# Altium project 724452_RPL-HX_Mobile_AEP_Rev0p91.PrjPcb (part 1 of 13)
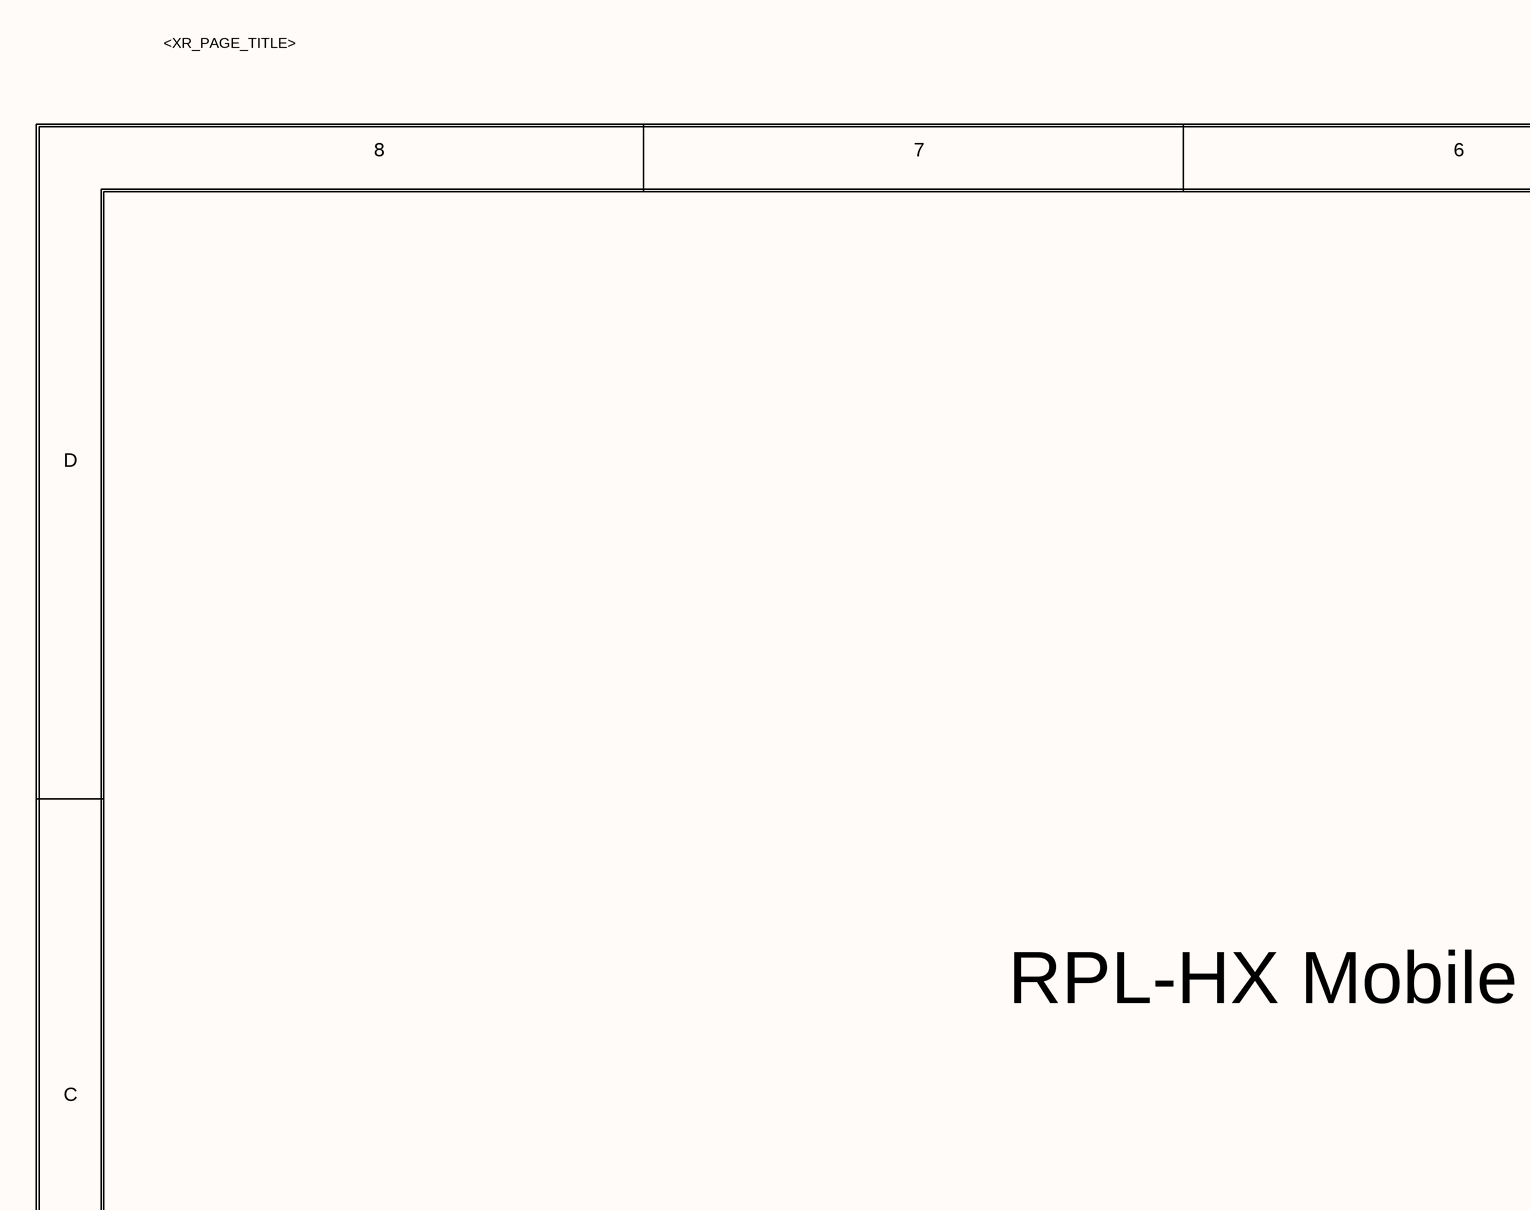
[diagram p0: 0001_TITLE.SchDoc, top left]
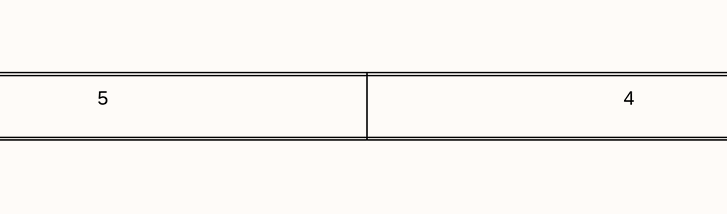
[diagram p1: 0001_TITLE.SchDoc, top middle]
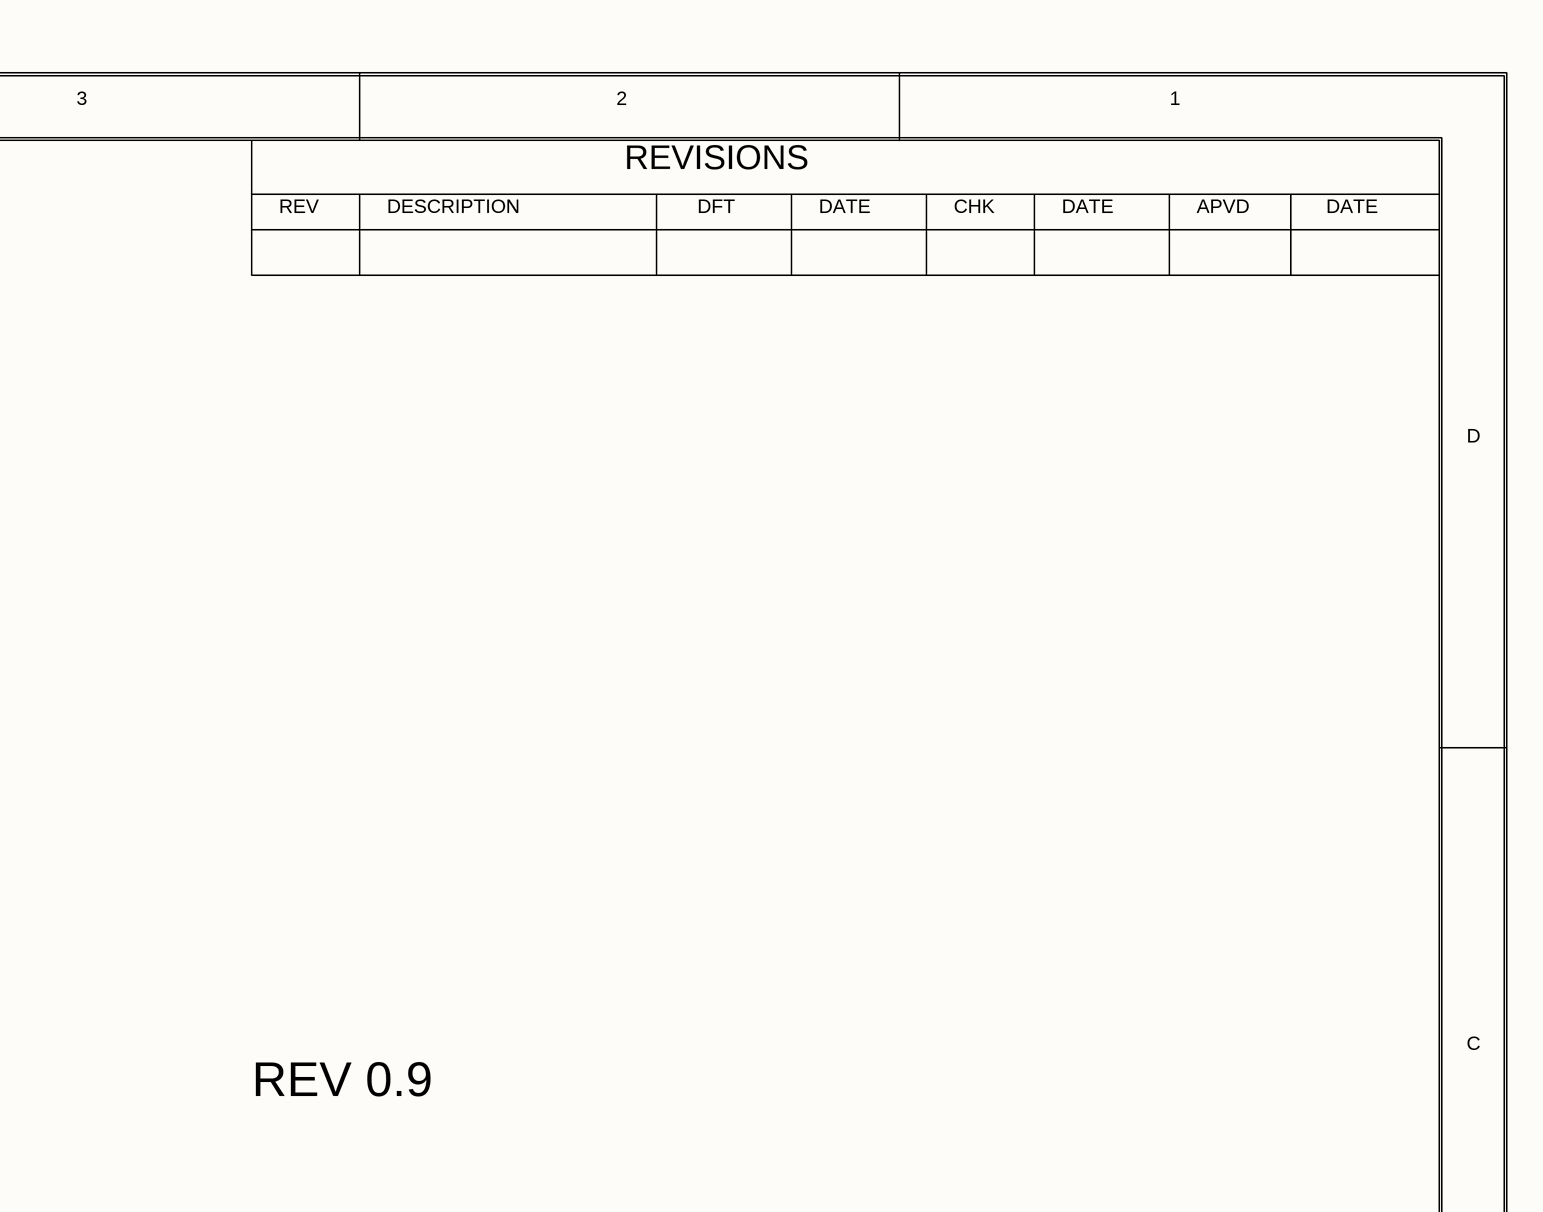
[diagram p2: 0001_TITLE.SchDoc, top right]
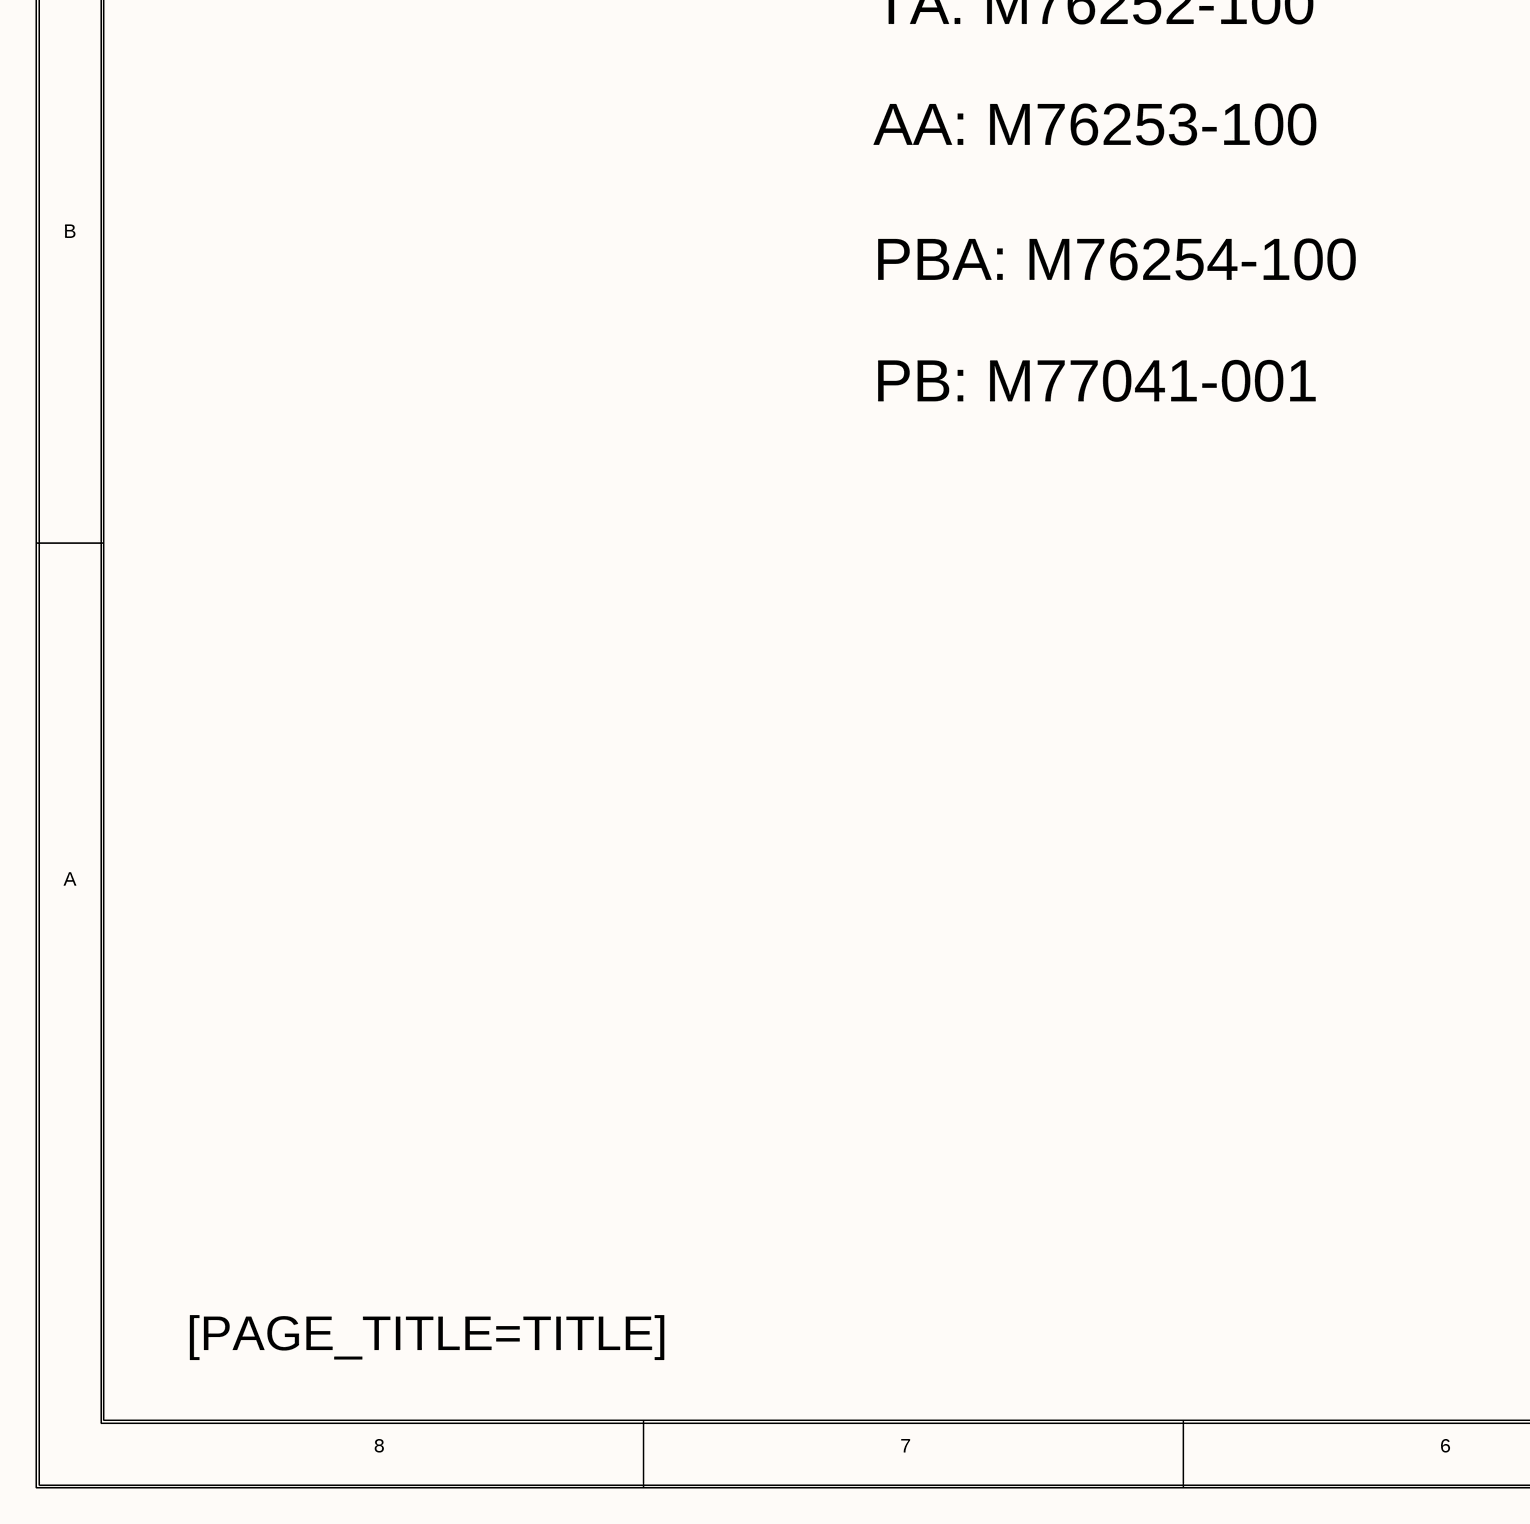
[diagram p3: 0001_TITLE.SchDoc, bottom left]
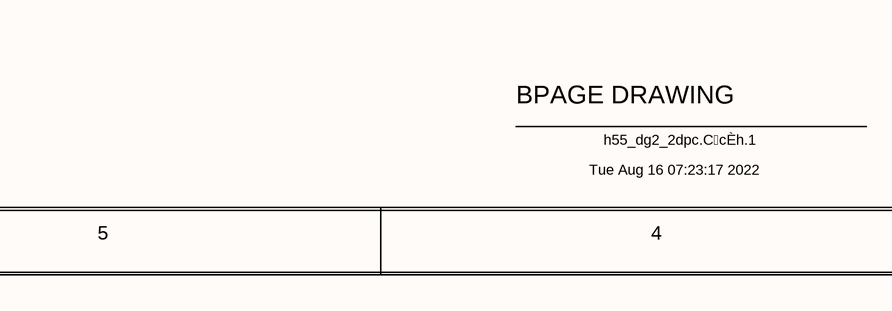
[diagram p4: 0001_TITLE.SchDoc, bottom middle]
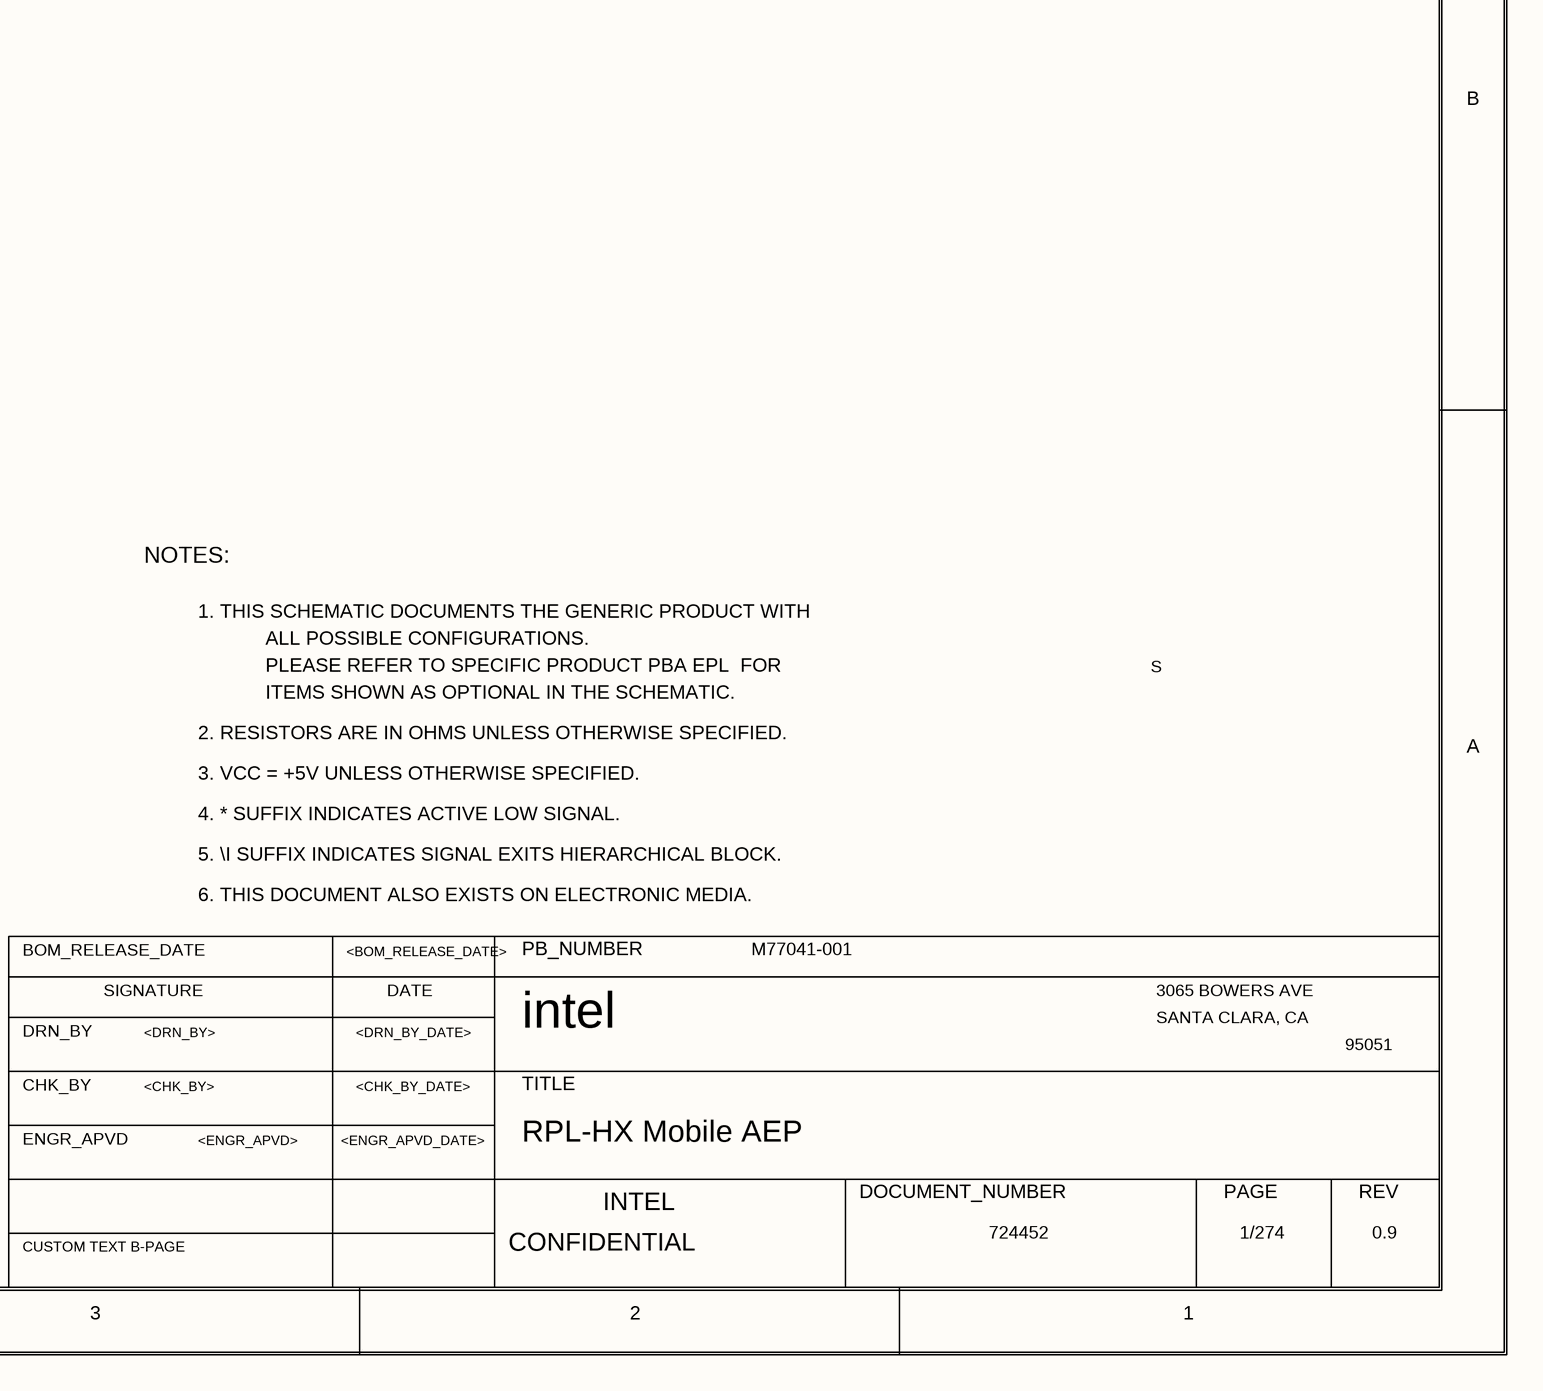
[diagram p5: 0001_TITLE.SchDoc, bottom right]
57 sheets, 1108 parts. Net scope: flat (ports and power ports of the same name join across sheets).
Sheets:
  0001_TITLE.SchDoc
  0002_INDEX -1.SchDoc
  0003_INDEX -2.SchDoc
  0004_INDEX -3.SchDoc
  0005_BLOCK DIAGRAM - MA.SchDoc
  0006_BLOCK DIAGRAM - PO.SchDoc
  0012_Processor - PEG, D.SchDoc
  0013_Processor - DISPLA.SchDoc
  0014_Processor - MEMORY.SchDoc
  0015_Processor - MEMORY.SchDoc
  0016_Processor - PM , C.SchDoc
  0017_Processor - MISC.SchDoc
  0021_Processor PD BOM -.SchDoc
  0022_Processor - CPU ST.SchDoc
  0024_DDR5 SODIMM CONTRO.SchDoc
  0026_DDR5 SODIMM CONTRO.SchDoc
  0029_System_debug_conne.SchDoc
  0030_DEBUG_CARD_SPI_SIG.SchDoc
  0031_DEBUG-XDP_SERIES_T.SchDoc
  0032_DEGUG-JTAG.SchDoc
  0034_PCH_CLOCK.SchDoc
  0035_PCH H CLOCK OPTION.SchDoc
  0036_PCH_DMI.SchDoc
  0037_PCH_PCIe_SATA.SchDoc
  0038_PCH_USB.SchDoc
  0039_GPP_C_D_E.SchDoc
  0040_GPP_I_J_K_R_S.SchDoc
  0041_PCH_PWR_GND.SchDoc
  0042_PCH_PI_BOM.SchDoc
  0043_GPP_MUX_E.SchDoc
  0044_RPL PCH H GPIO OPT.SchDoc
  0045_PCH STRAPS 1.SchDoc
  0046_PCH STRAPS 2.SchDoc
  0047_PCH VALIDATION.SchDoc
  0049_GLITCH FREE CIRCUI.SchDoc
  0052_PCIe_X16.SchDoc
  0053_PCIE GEN5_MISC.SchDoc
  0054_eDP_CONNECTOR.SchDoc
  0055_LED CON.SchDoc
  0058_DISPLAY SHIFT-POWE.SchDoc
  0059_CAMERA_CONNECTOR.SchDoc
  0062_HDMI0_CONNECTOR .SchDoc
  0063_HDMI1_CONNECTOR.SchDoc
  0071_HSIO MUXING -2.SchDoc
  0072_HSIO MUXING -3.SchDoc
  0073_HSIO MUXING -4.SchDoc
  0074_S0IX_REQ_ACK_OPTIO.SchDoc
  0076_TBT_0_PA_CONNECTOR.SchDoc
  0077_TBT_0_PB_CONNECTOR.SchDoc
  0082_USB3.SchDoc
  0083_USB3.SchDoc
  0084_USB3.SchDoc
  0090_USB3.SchDoc
  0091_USB3.SchDoc
  0093_M.2 KEY-E WLAN-BT.SchDoc
  0095_GBIT LAN - FOXVILLE LAN PHY CHIP.SchDoc
  0096_CONNECTIVITY - FOX.SchDoc

## Sheet 0001_TITLE.SchDoc
size 848 x 558 mm

### Notes on the sheet
- <XR_PAGE_TITLE>
- 8
- 7
- 6
- 5
- 4
- 3
- 2
- 1
- REVISIONS
- REV
- DESCRIPTION
- DFT
- DATE
- CHK
- APVD
- D
- RPL-HX Mobile AEP
- C
- REV 0.9
- TA: M76252-100
- AA: M76253-100
- B
- PBA: M76254-100
- PB: M77041-001
- NOTES:
- 1. THIS SCHEMATIC DOCUMENTS THE GENERIC PRODUCT WITH
- PLEASE REFER TO SPECIFIC PRODUCT PBA EPL  FOR
- ALL POSSIBLE CONFIGURATIONS.
- S
- 2. RESISTORS ARE IN OHMS UNLESS OTHERWISE SPECIFIED.
- ITEMS SHOWN AS OPTIONAL IN THE SCHEMATIC.
- A
- 3. VCC = +5V UNLESS OTHERWISE SPECIFIED.
- 4. * SUFFIX INDICATES ACTIVE LOW SIGNAL.
- 5. \I SUFFIX INDICATES SIGNAL EXITS HIERARCHICAL BLOCK.
- 6. THIS DOCUMENT ALSO EXISTS ON ELECTRONIC MEDIA.
- BOM_RELEASE_DATE
- SIGNATURE
- <BOM_RELEASE_DATE>
- PB_NUMBER
- M77041-001
- 3065 BOWERS AVE
- DRN_BY
- <DRN_BY>
- <DRN_BY_DATE>
- intel
- SANTA CLARA, CA
- 95051
- ENGR_APVD
- CHK_BY
- <CHK_BY>
- <ENGR_APVD>
- <ENGR_APVD_DATE>
- <CHK_BY_DATE>
- TITLE
- BPAGE DRAWING
- INTEL
- DOCUMENT_NUMBER
- PAGE
- [PAGE_TITLE=TITLE]
- Tue Aug 16 07:23:17 2022
- h55_dg2_2dpc.CcÈh.1
- CUSTOM TEXT B-PAGE
- CONFIDENTIAL
- 724452
- 1/274
- 0.9

## Sheet 0002_INDEX -1.SchDoc
size 891 x 558 mm
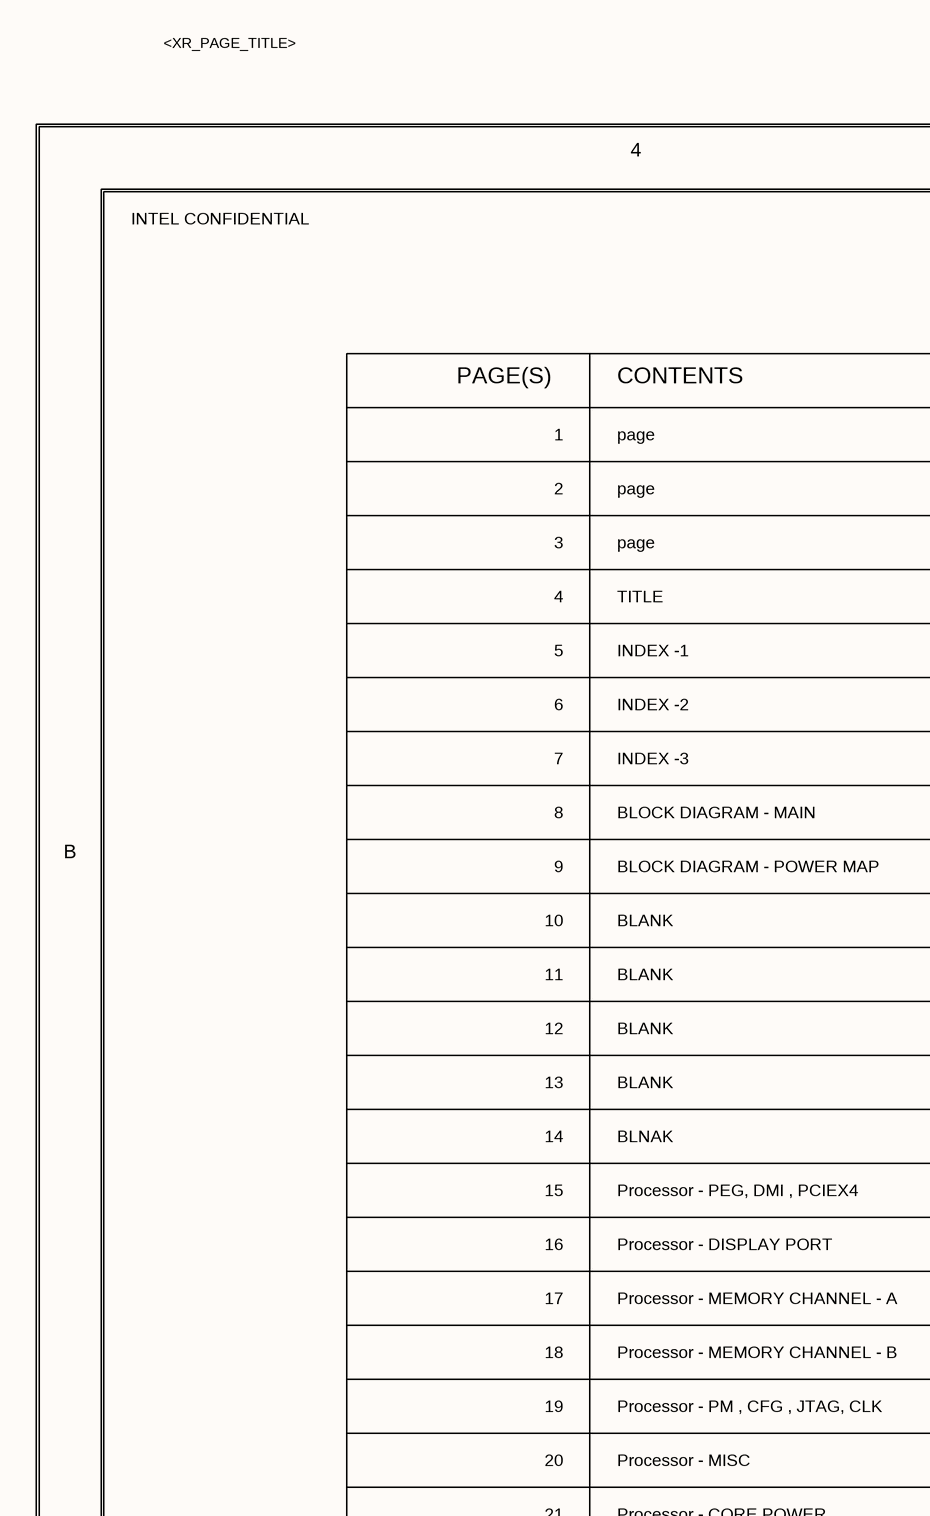
[diagram p6: 0002_INDEX -1.SchDoc, top left]
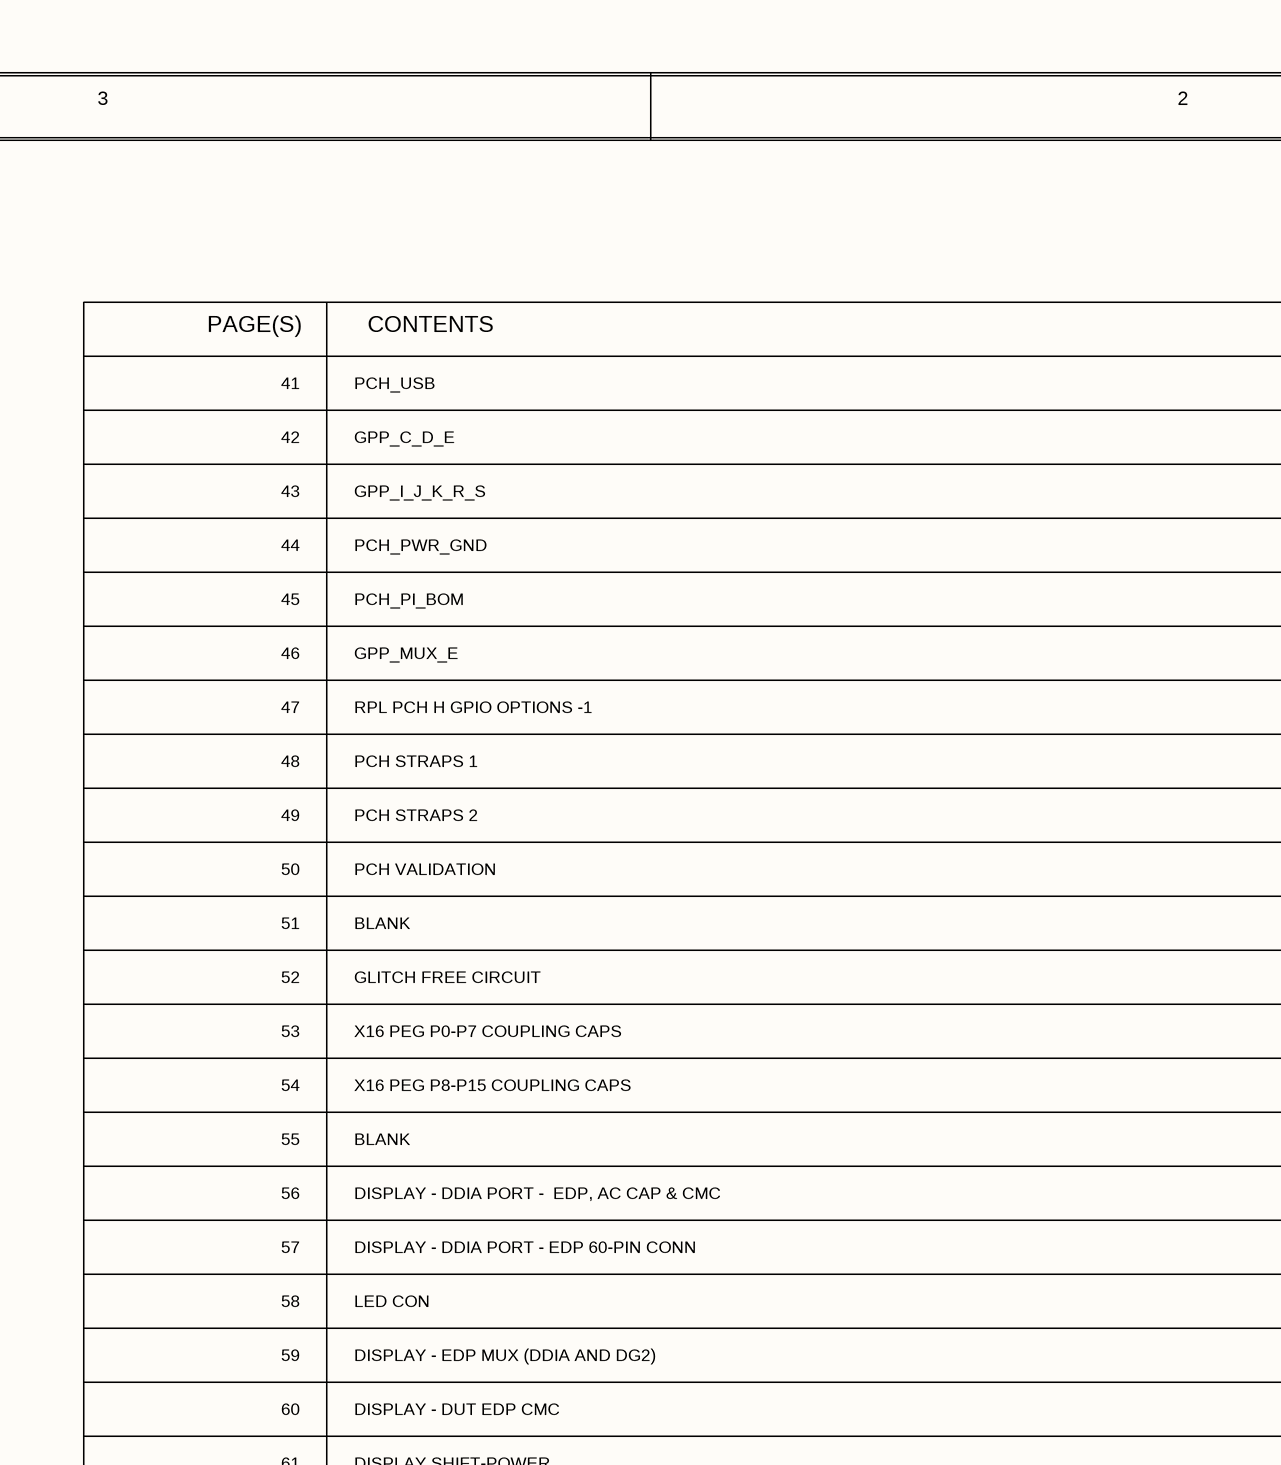
[diagram p7: 0002_INDEX -1.SchDoc, top middle]
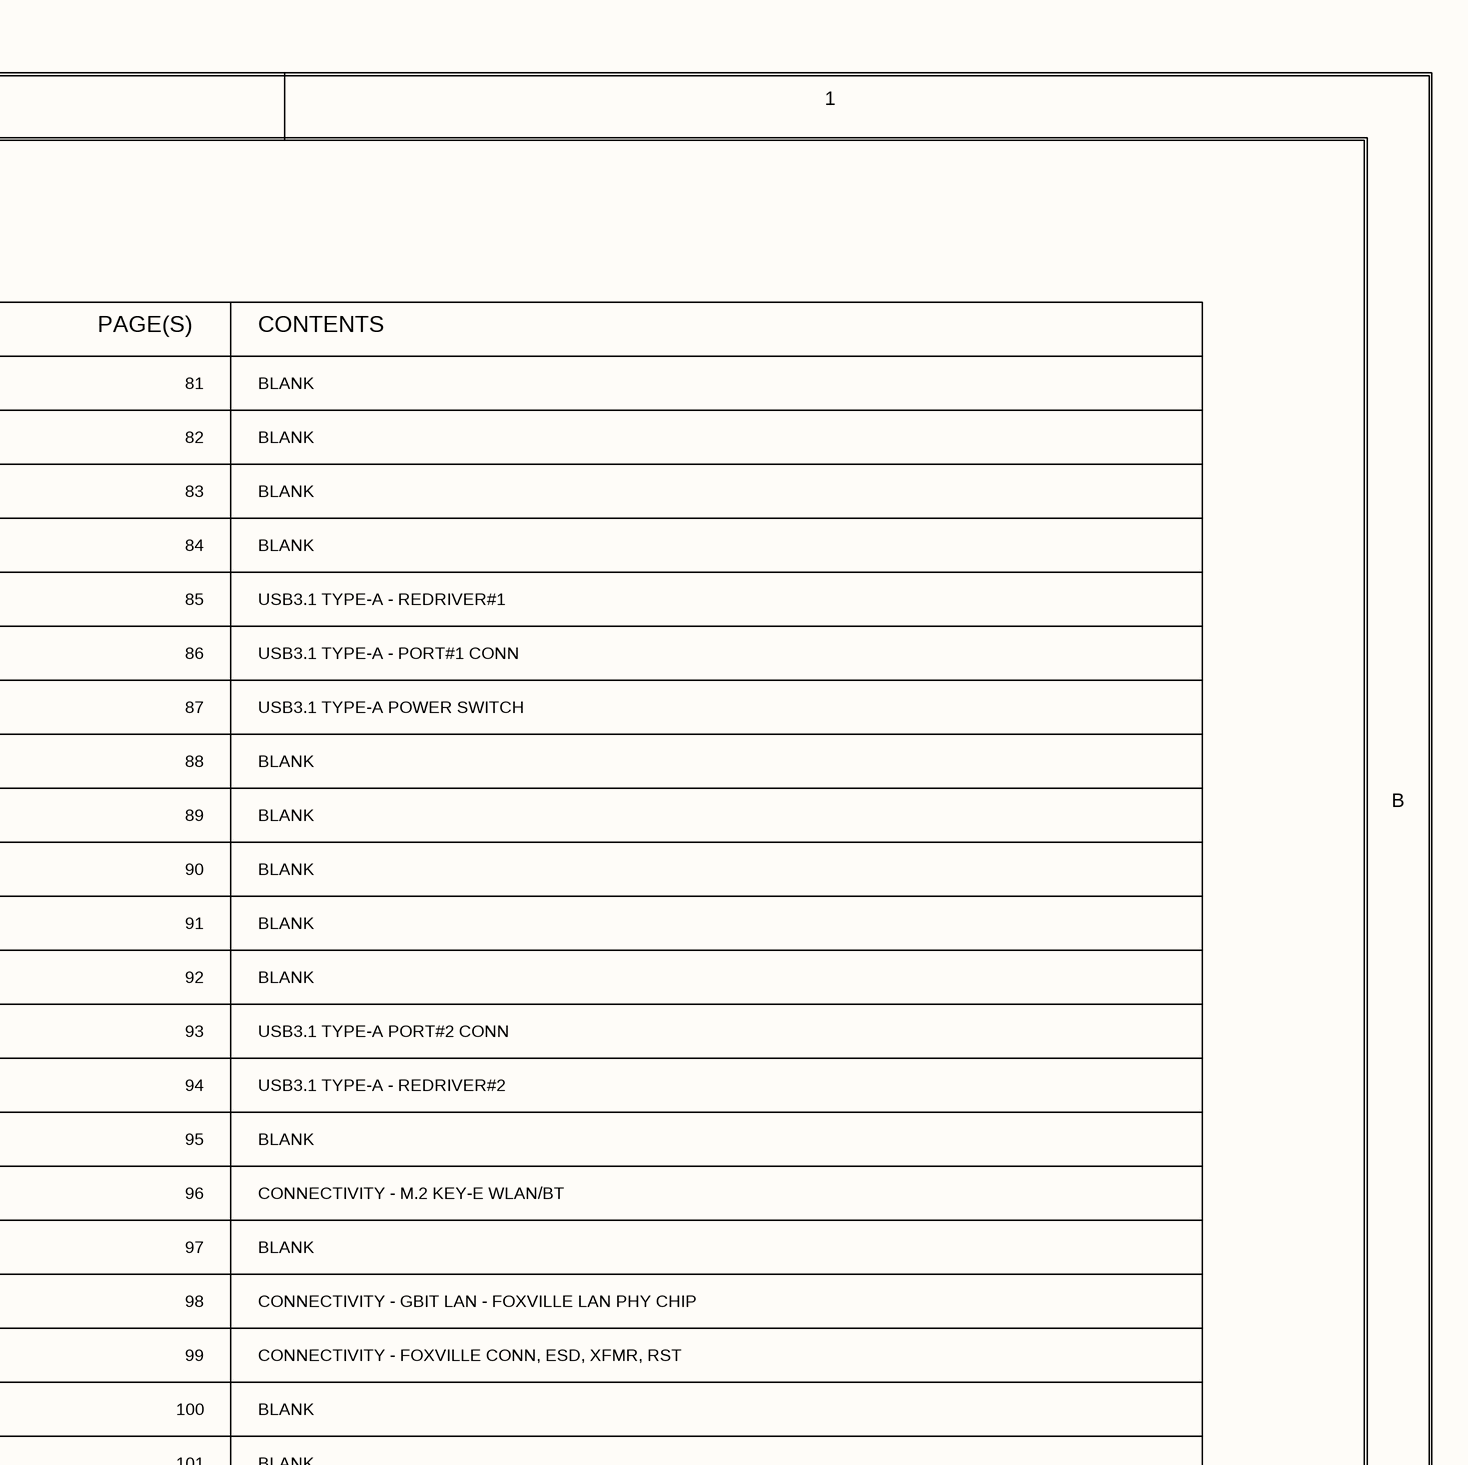
[diagram p8: 0002_INDEX -1.SchDoc, top right]
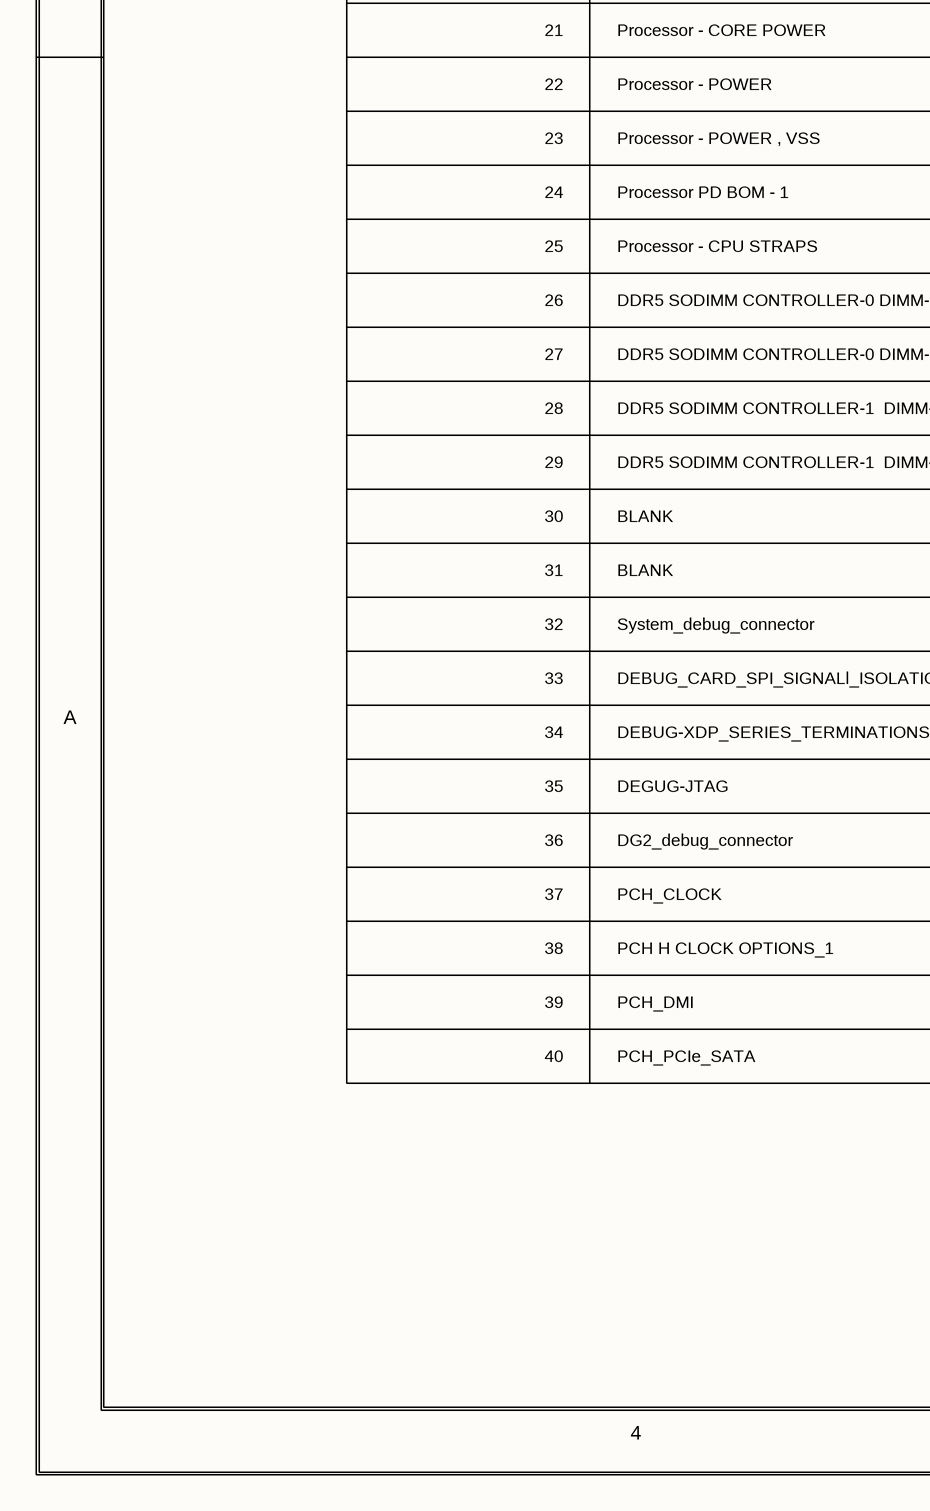
[diagram p9: 0002_INDEX -1.SchDoc, bottom left]
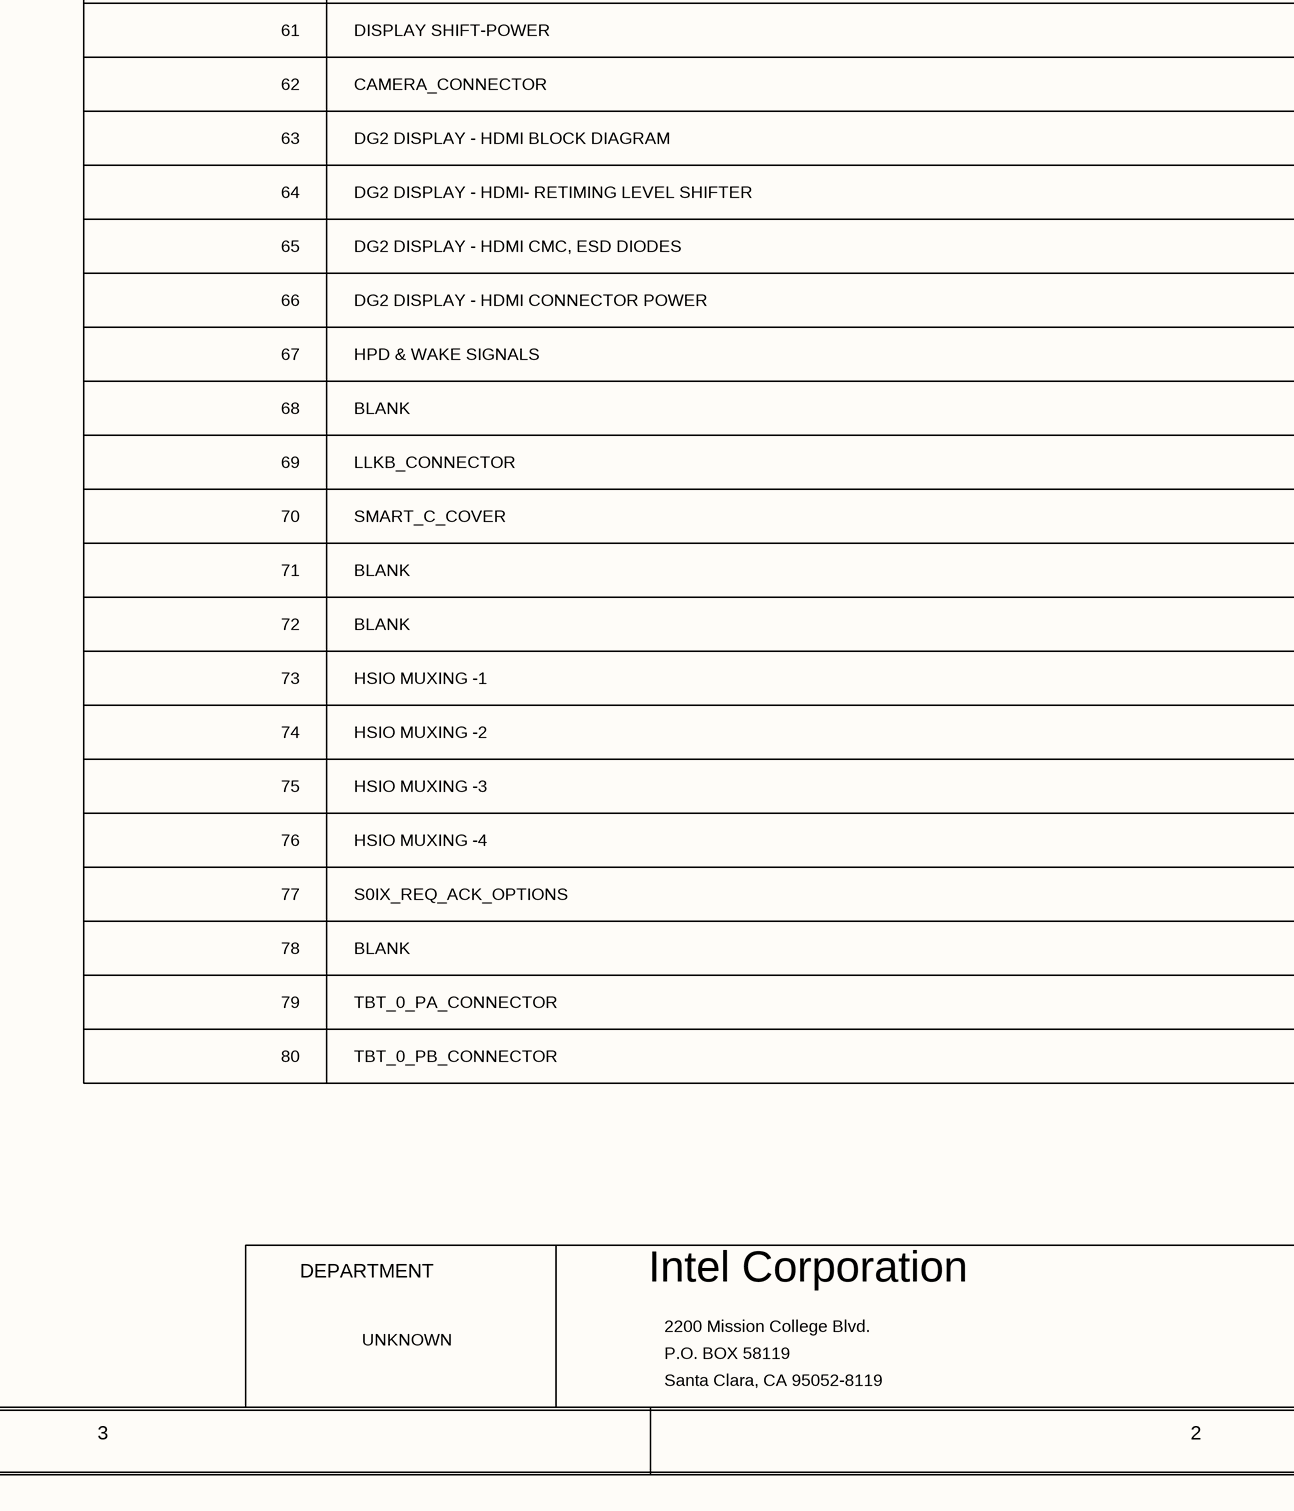
[diagram p10: 0002_INDEX -1.SchDoc, bottom middle]
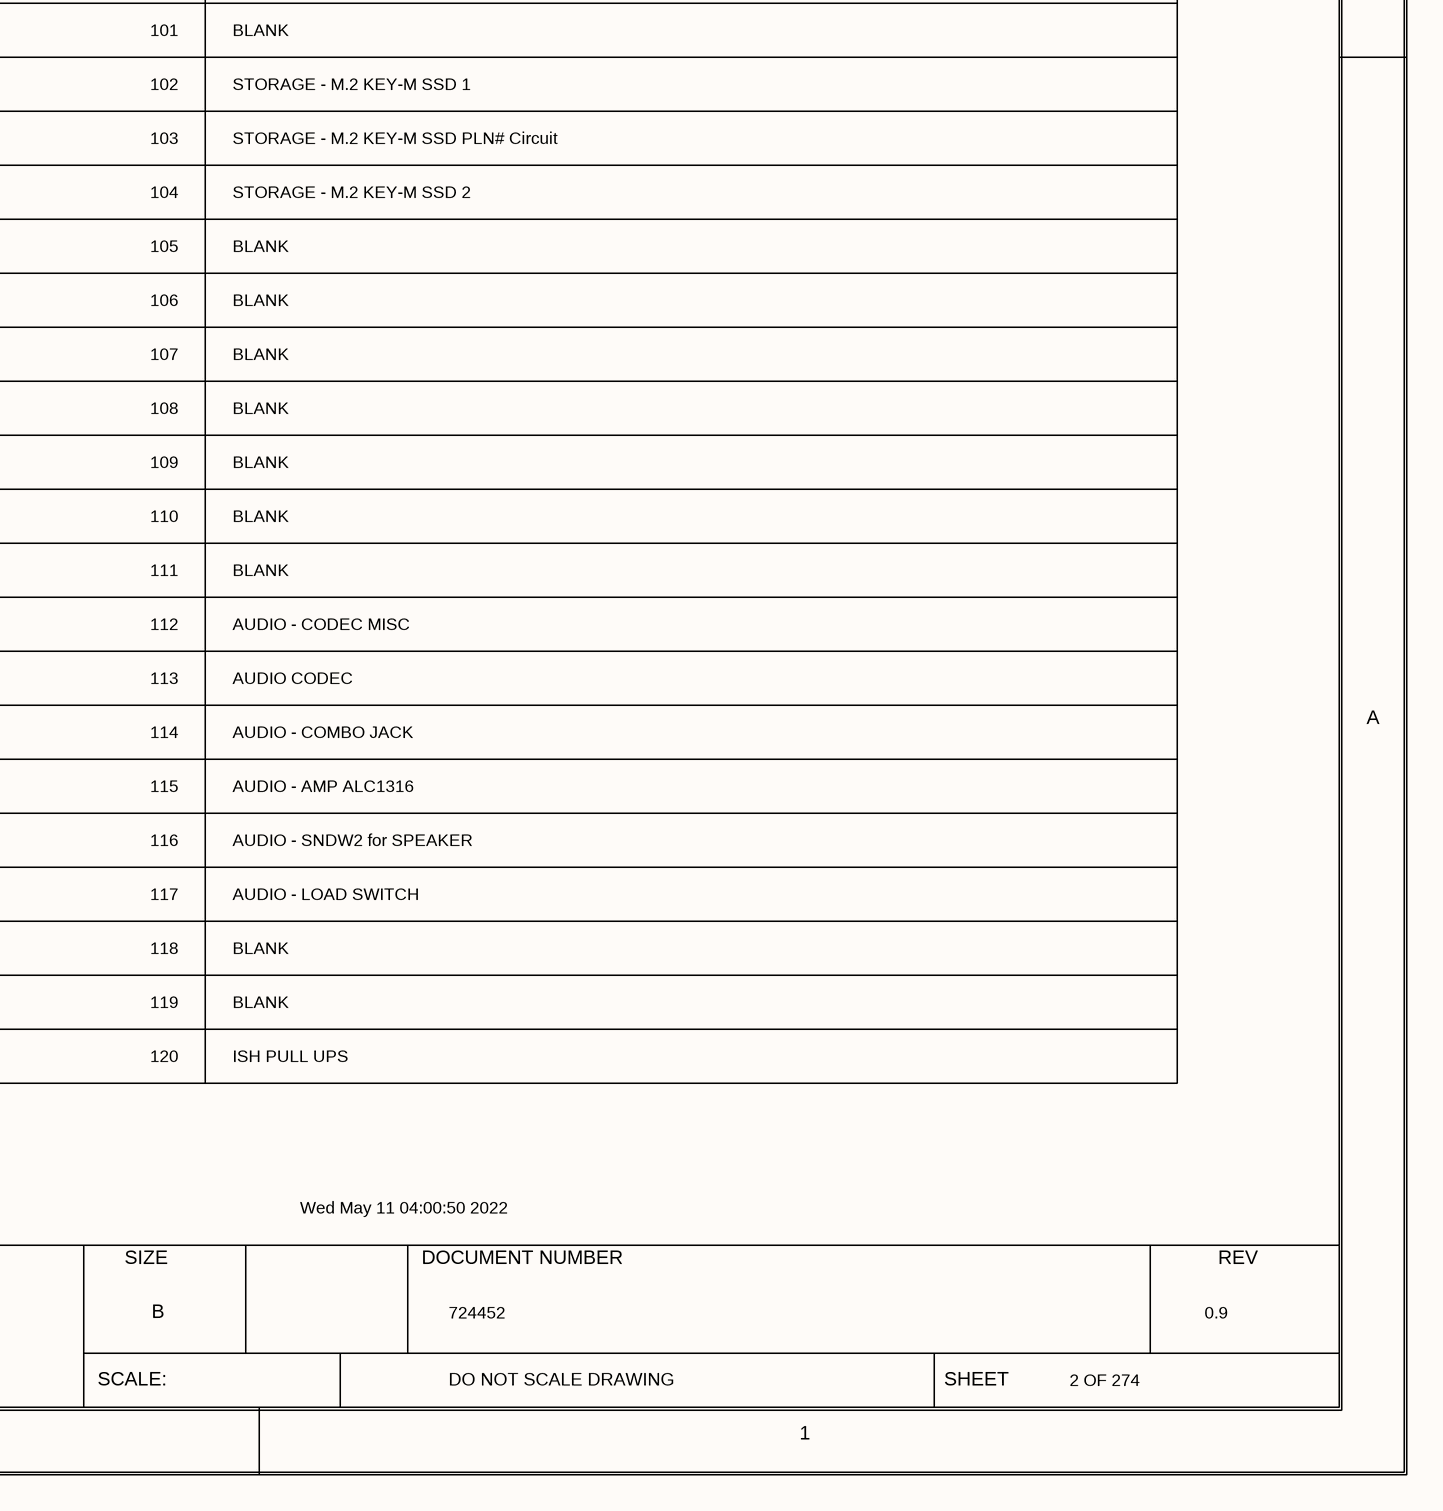
[diagram p11: 0002_INDEX -1.SchDoc, bottom right]

### Notes on the sheet
- <XR_PAGE_TITLE>
- 4
- 3
- 2
- 1
- INTEL CONFIDENTIAL
- PAGE(S)
- CONTENTS
- page
- 41
- PCH_USB
- 81
- BLANK
- 42
- GPP_C_D_E
- 82
- 43
- GPP_I_J_K_R_S
- 83
- 5
- TITLE
- INDEX -1
- 44
- 45
- PCH_PI_BOM
- PCH_PWR_GND
- 85
- 84
- USB3.1 TYPE-A - REDRIVER#1
- 6
- INDEX -2
- 46
- GPP_MUX_E
- 86
- USB3.1 TYPE-A - PORT#1 CONN
- 7
- INDEX -3
- 47
- RPL PCH H GPIO OPTIONS -1
- 87
- USB3.1 TYPE-A POWER SWITCH
- B
- 8
- BLOCK DIAGRAM - MAIN
- 48
- PCH STRAPS 1
- 88
- 10
- 9
- BLOCK DIAGRAM - POWER MAP
- 49
- 50
- PCH STRAPS 2
- PCH VALIDATION
- 89
- 90
- 11
- 51
- 91
- 12
- 52
- GLITCH FREE CIRCUIT
- 92
- 13
- 53
- X16 PEG P0-P7 COUPLING CAPS
- 93
- USB3.1 TYPE-A PORT#2 CONN
- 14
- 15
- BLNAK
- Processor - PEG, DMI , PCIEX4
- 55
- 54
- X16 PEG P8-P15 COUPLING CAPS
- 94
- 95
- USB3.1 TYPE-A - REDRIVER#2
- 16
- Processor - DISPLAY PORT
- 56
- DISPLAY - DDIA PORT -  EDP, AC CAP & CMC
- 96
- CONNECTIVITY - M.2 KEY-E WLAN/BT
- 17
- Processor - MEMORY CHANNEL - A
- 57
- DISPLAY - DDIA PORT - EDP 60-PIN CONN
- 97
- 18
- Processor - MEMORY CHANNEL - B
- 58
- LED CON
- 98
- CONNECTIVITY - GBIT LAN - FOXVILLE LAN PHY CHIP
- 19
- 20
- Processor - PM , CFG , JTAG, CLK
- Processor - MISC
- 59
- 60
- DISPLAY - EDP MUX (DDIA AND DG2)
- DISPLAY - DUT EDP CMC
- 100
- 99
- CONNECTIVITY - FOXVILLE CONN, ESD, XFMR, RST
- 21
- Processor - CORE POWER
- 61
- DISPLAY SHIFT-POWER
- 101
- 22
- Processor - POWER
- 62
- CAMERA_CONNECTOR
- 102
- STORAGE - M.2 KEY-M SSD 1
- 23
- Processor - POWER , VSS
- 63
- DG2 DISPLAY - HDMI BLOCK DIAGRAM
- 103
- STORAGE - M.2 KEY-M SSD PLN# Circuit
- 24
- 25
- Processor PD BOM - 1
- Processor - CPU STRAPS
- 64
- 65
- DG2 DISPLAY - HDMI CMC, ESD DIODES
- DG2 DISPLAY - HDMI- RETIMING LEVEL SHIFTER
- 105
- 104
- STORAGE - M.2 KEY-M SSD 2
- 26
- DDR5 SODIMM CONTROLLER-0 DIMM-0
- 66
- DG2 DISPLAY - HDMI CONNECTOR POWER
- 106
- 27
- 67
- HPD & WAKE SIGNALS
- 107
- 28
- DDR5 SODIMM CONTROLLER-1  DIMM-0
- 68
- 108
- 29
- 30
- 70
- 69
- SMART_C_COVER
- LLKB_CONNECTOR
- 110
- 109
- 31
- 71
- 111
- 32
- System_debug_connector
- 72
- 112
- AUDIO - CODEC MISC
- A
- 33
- DEBUG_CARD_SPI_SIGNALl_ISOLATION
- 73
- HSIO MUXING -1
- 113
- AUDIO CODEC
- 34
- 35
- DEBUG-XDP_SERIES_TERMINATIONS
- DEGUG-JTAG
- 75
- 74
- HSIO MUXING -3
- HSIO MUXING -2
- 115
- 114
- AUDIO - AMP ALC1316
- AUDIO - COMBO JACK
- 36
- DG2_debug_connector
- 76
- HSIO MUXING -4
- 116
- AUDIO - SNDW2 for SPEAKER
- 37
- PCH_CLOCK
- 77
- S0IX_REQ_ACK_OPTIONS
- 117
- AUDIO - LOAD SWITCH
- 38
- PCH H CLOCK OPTIONS_1
- 78
- 118
- 40
- 39
- PCH_DMI
- PCH_PCIe_SATA
- 80
- 79
- TBT_0_PA_CONNECTOR
- TBT_0_PB_CONNECTOR
- 119
- 120
- ISH PULL UPS
- Wed May 11 04:00:50 2022
- SIZE
- DOCUMENT NUMBER
- REV
- DEPARTMENT
- Intel Corporation
- 2200 Mission College Blvd.
- 724452
- 0.9
- UNKNOWN
- P.O. BOX 58119
- Santa Clara, CA 95052-8119
- SCALE:
- DO NOT SCALE DRAWING
- SHEET
- 2 OF 274

## Sheet 0003_INDEX -2.SchDoc
size 848 x 558 mm
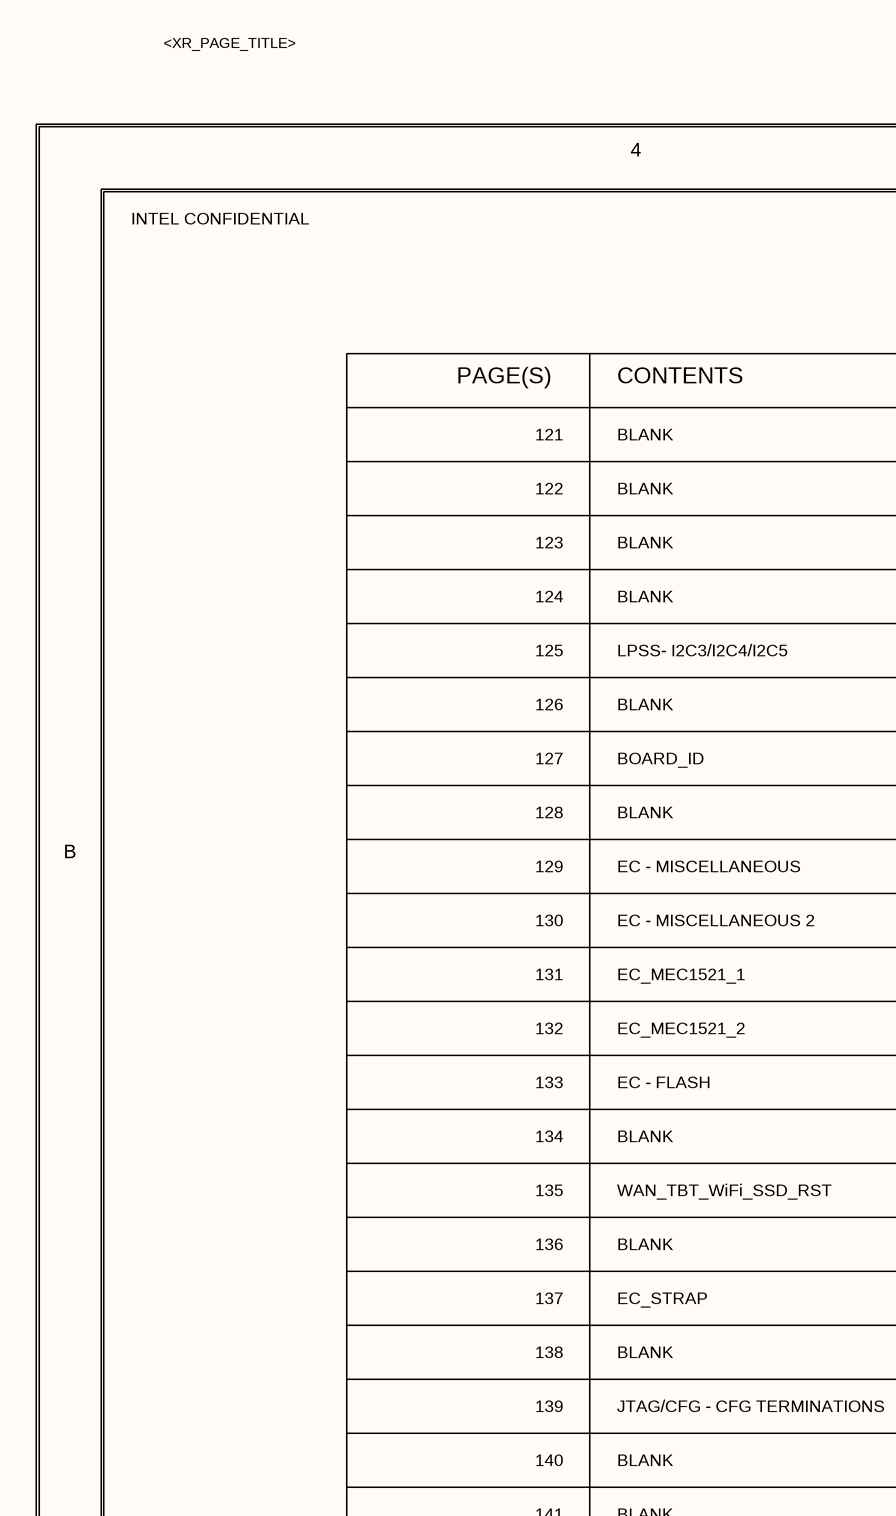
[diagram p12: 0003_INDEX -2.SchDoc, top left]
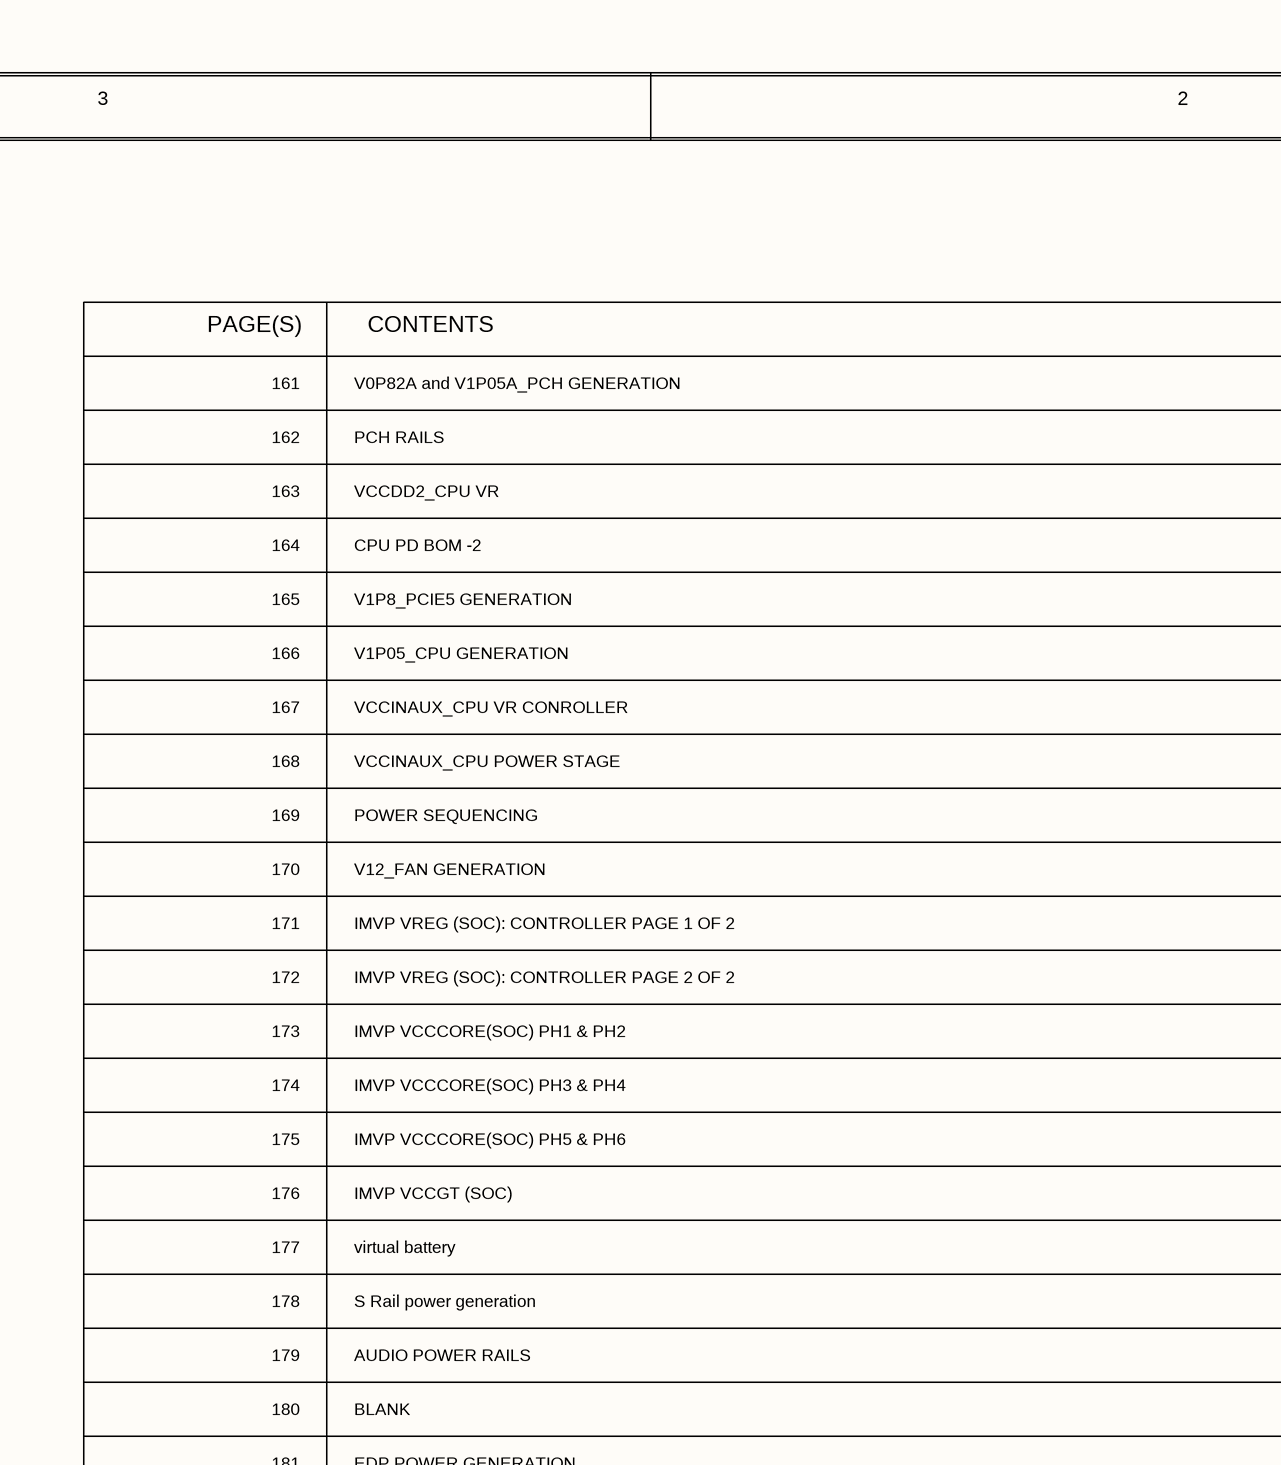
[diagram p13: 0003_INDEX -2.SchDoc, top middle]
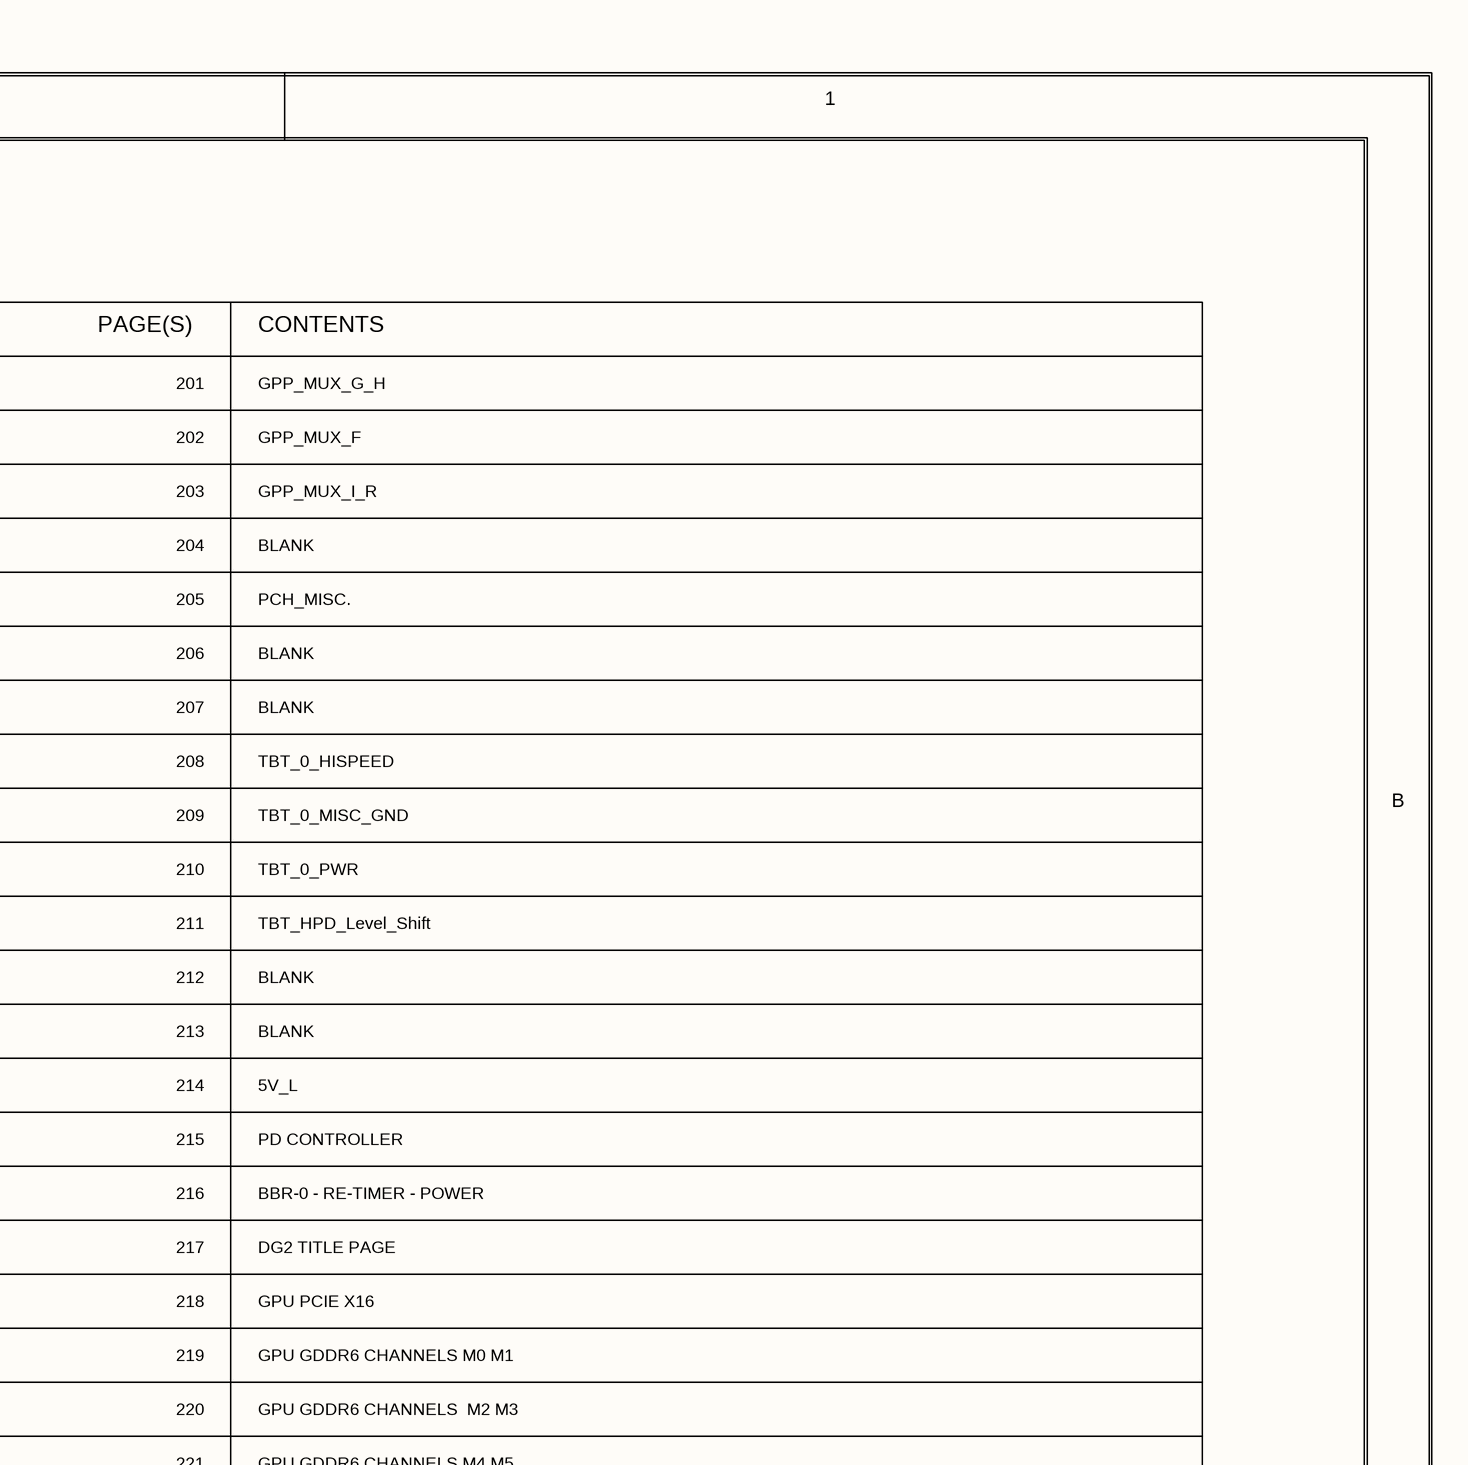
[diagram p14: 0003_INDEX -2.SchDoc, top right]
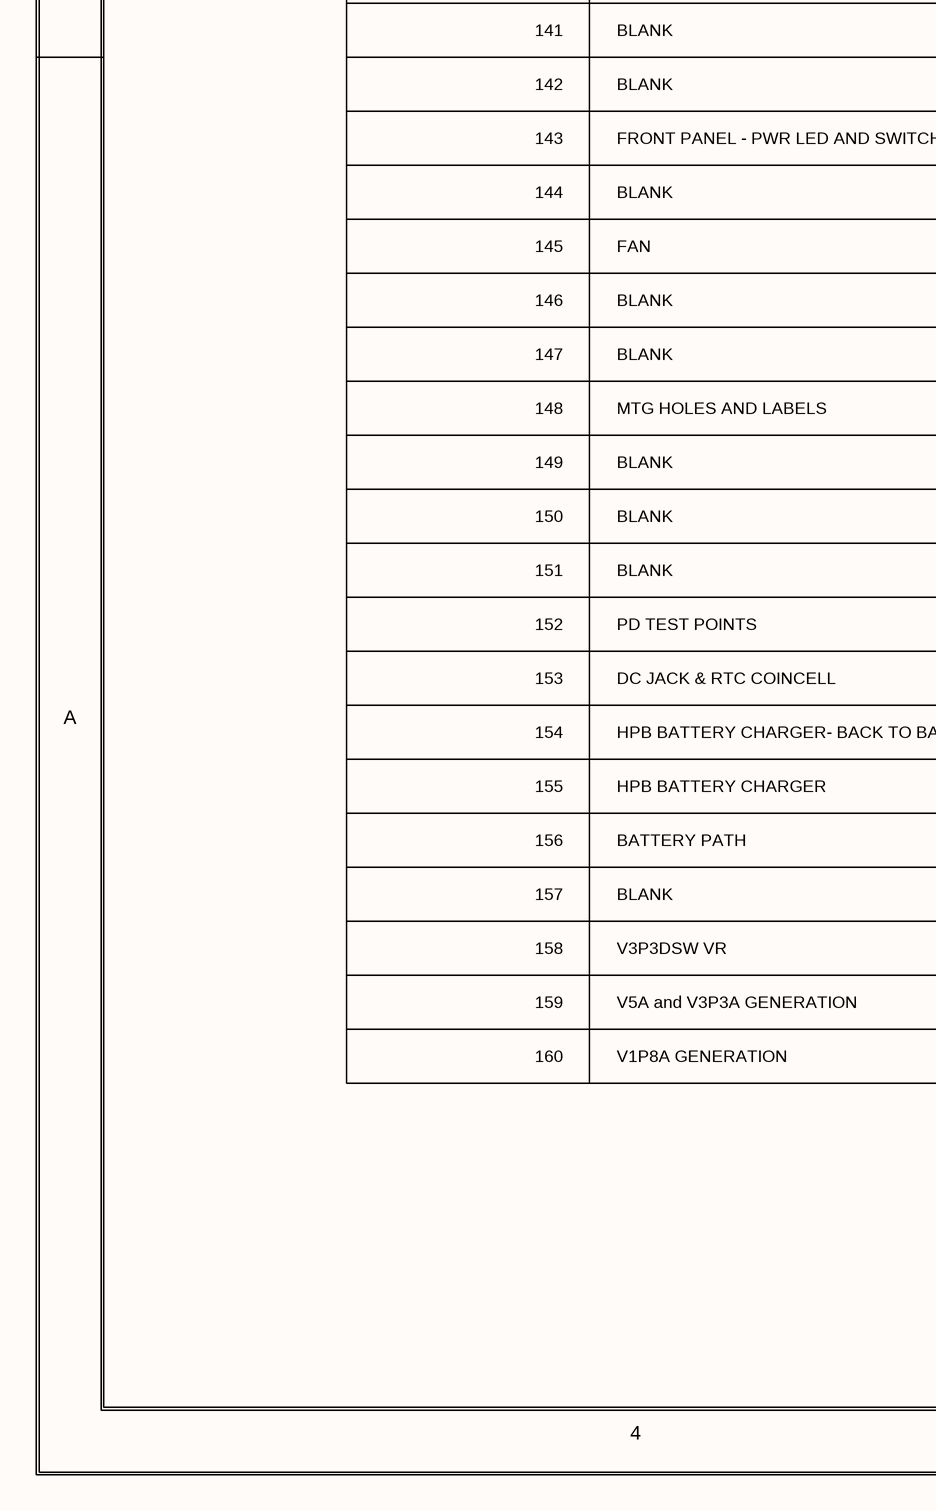
[diagram p15: 0003_INDEX -2.SchDoc, bottom left]
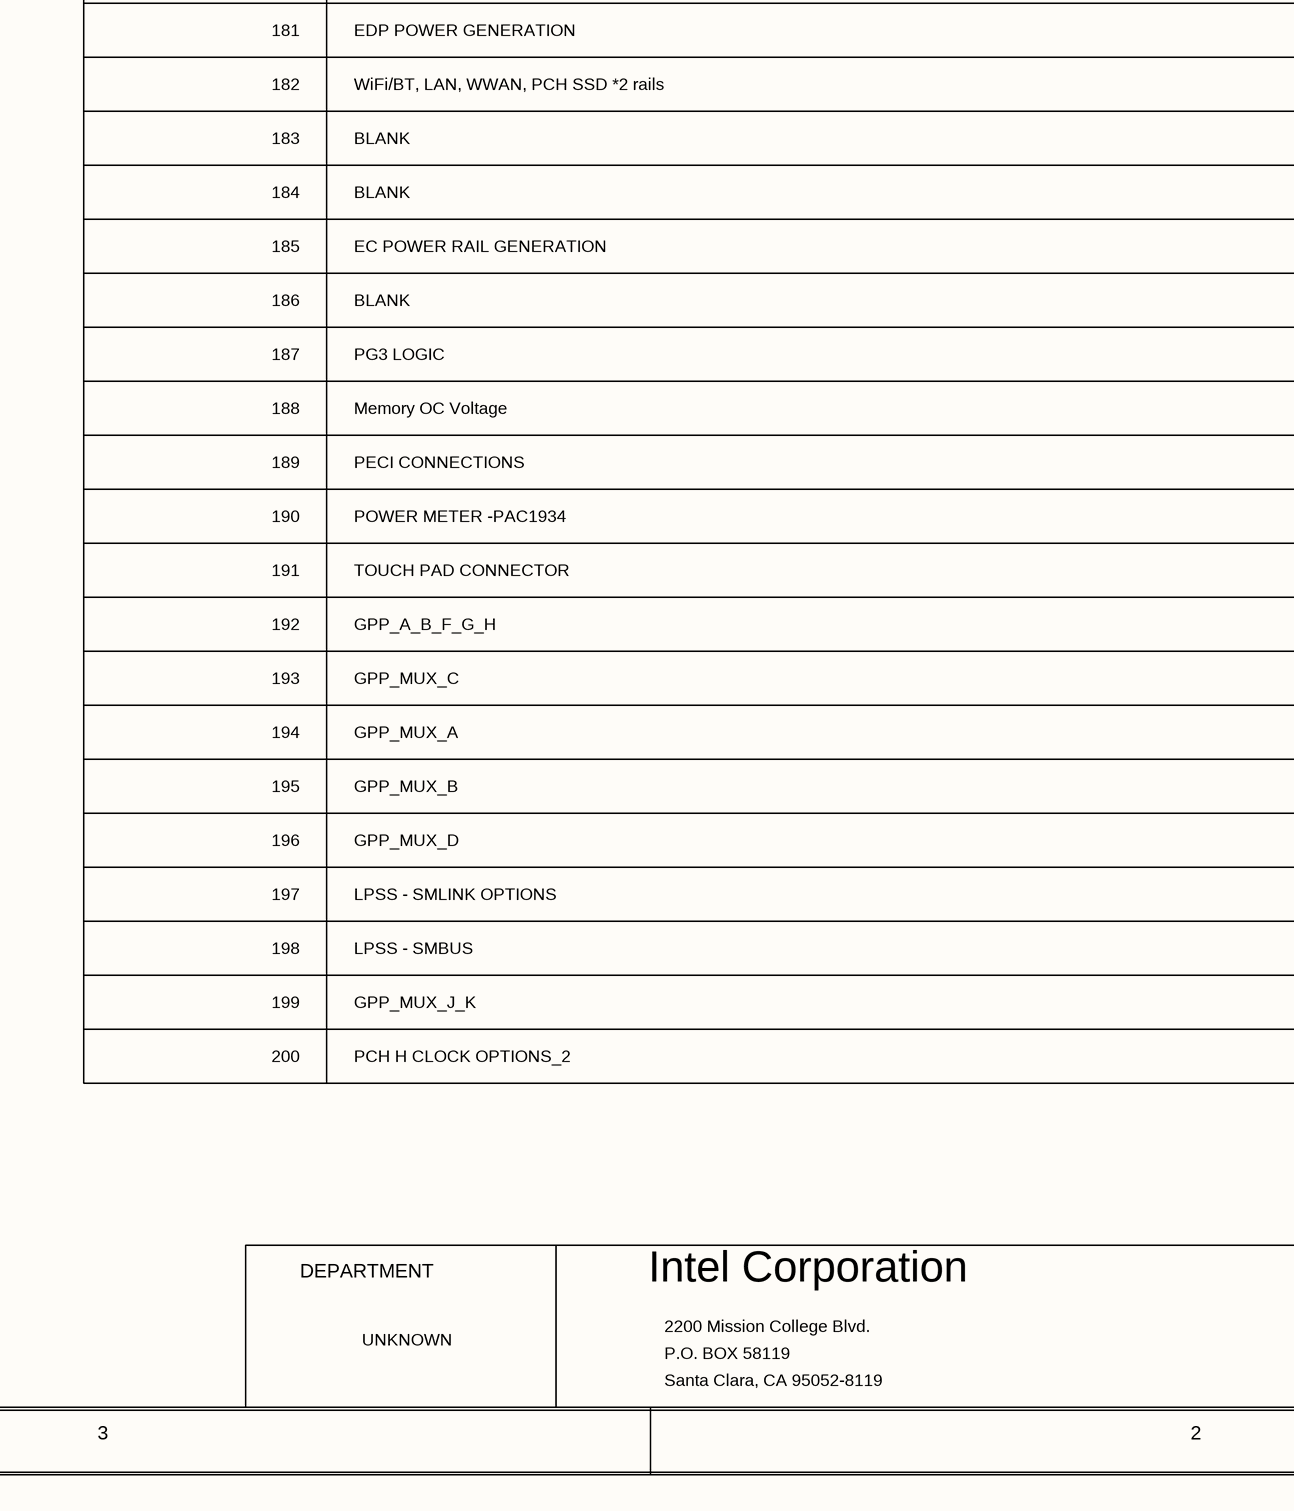
[diagram p16: 0003_INDEX -2.SchDoc, bottom middle]
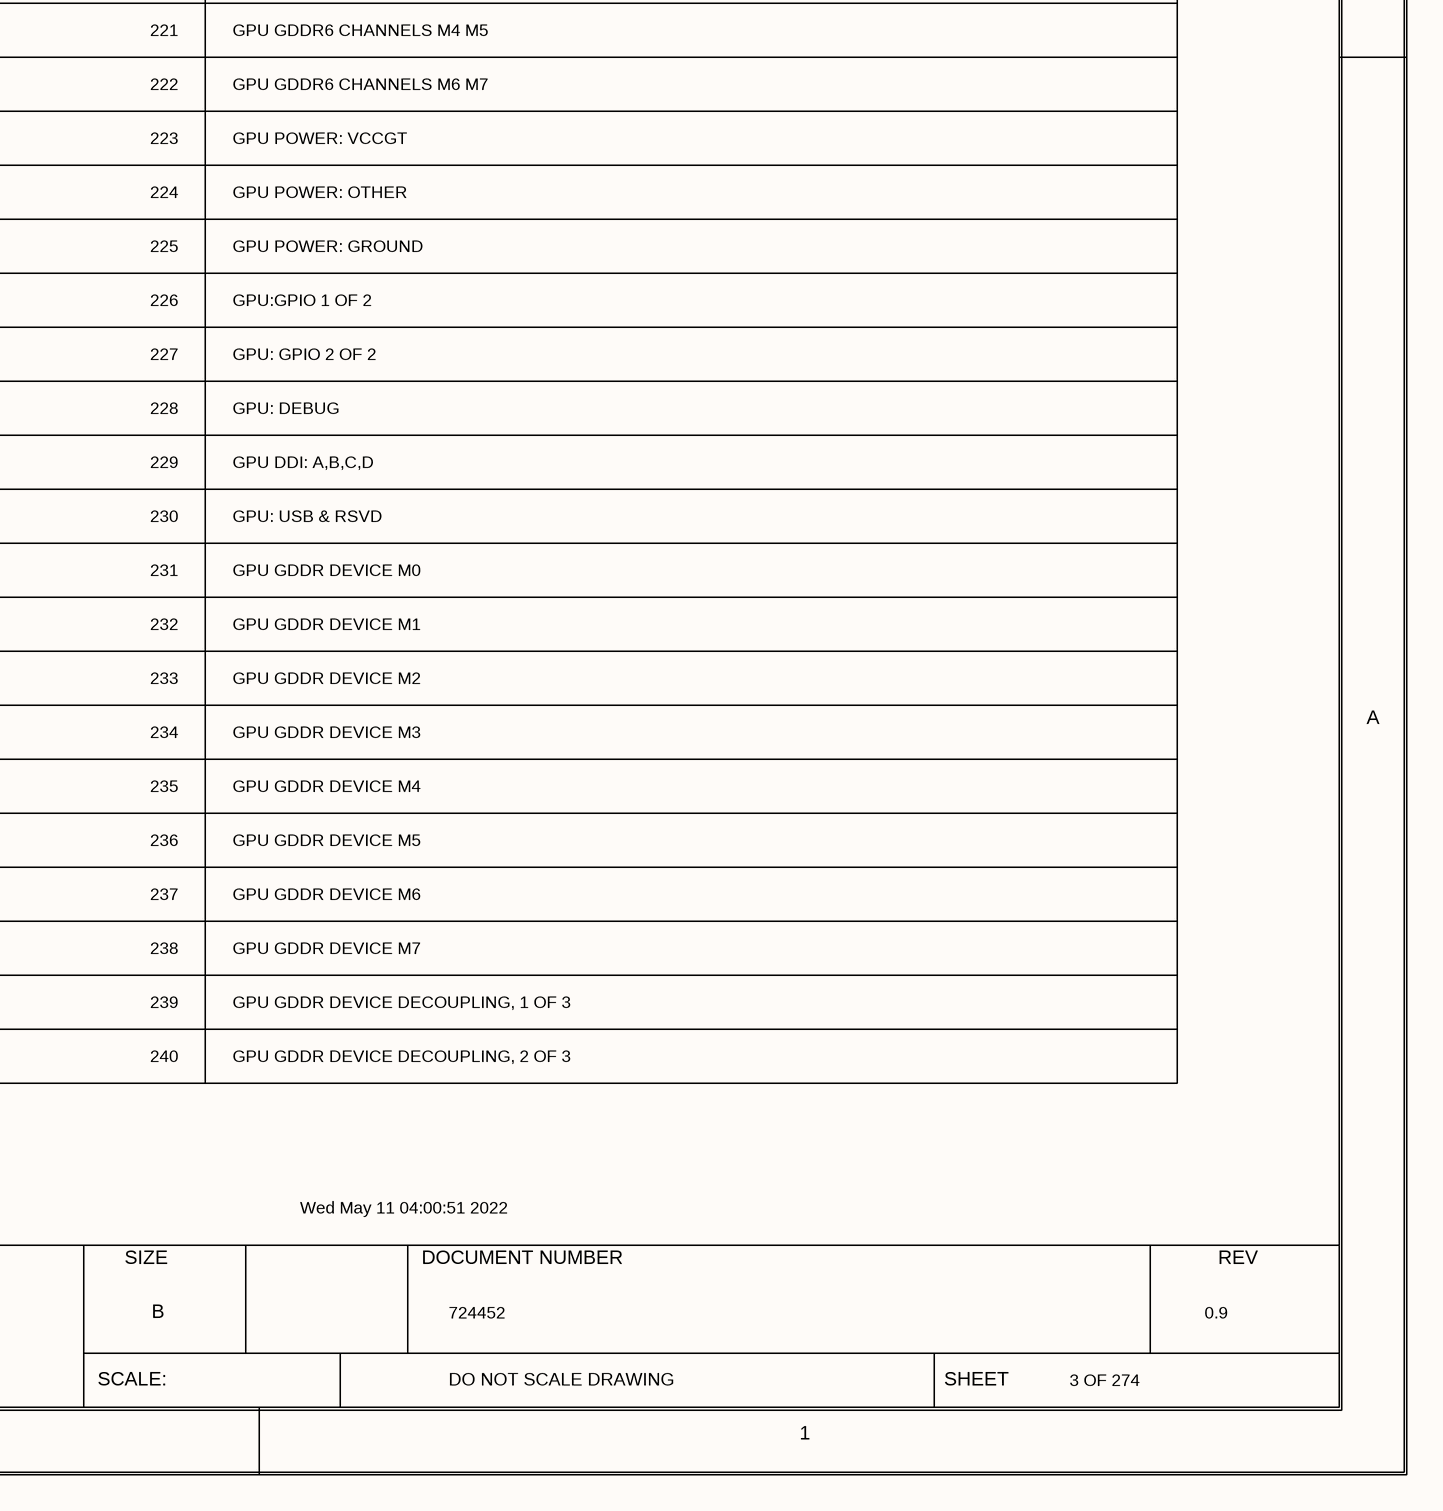
[diagram p17: 0003_INDEX -2.SchDoc, bottom right]

### Notes on the sheet
- <XR_PAGE_TITLE>
- 4
- 3
- 2
- 1
- INTEL CONFIDENTIAL
- PAGE(S)
- CONTENTS
- 121
- BLANK
- 161
- V0P82A and V1P05A_PCH GENERATION
- 201
- GPP_MUX_G_H
- 122
- 162
- PCH RAILS
- 202
- GPP_MUX_F
- 123
- 163
- VCCDD2_CPU VR
- 203
- GPP_MUX_I_R
- 124
- 125
- LPSS- I2C3/I2C4/I2C5
- 164
- 165
- V1P8_PCIE5 GENERATION
- CPU PD BOM -2
- 204
- 205
- PCH_MISC.
- 126
- 166
- V1P05_CPU GENERATION
- 206
- 127
- BOARD_ID
- 167
- VCCINAUX_CPU VR CONROLLER
- 207
- B
- 128
- 168
- VCCINAUX_CPU POWER STAGE
- 208
- TBT_0_HISPEED
- 129
- 130
- EC - MISCELLANEOUS 2
- EC - MISCELLANEOUS
- 170
- 169
- V12_FAN GENERATION
- POWER SEQUENCING
- 210
- 209
- TBT_0_PWR
- TBT_0_MISC_GND
- 131
- EC_MEC1521_1
- 171
- IMVP VREG (SOC): CONTROLLER PAGE 1 OF 2
- 211
- TBT_HPD_Level_Shift
- 132
- EC_MEC1521_2
- 172
- IMVP VREG (SOC): CONTROLLER PAGE 2 OF 2
- 212
- 133
- EC - FLASH
- 173
- IMVP VCCCORE(SOC) PH1 & PH2
- 213
- 135
- 134
- WAN_TBT_WiFi_SSD_RST
- 174
- 175
- IMVP VCCCORE(SOC) PH5 & PH6
- IMVP VCCCORE(SOC) PH3 & PH4
- 214
- 215
- PD CONTROLLER
- 5V_L
- 136
- 176
- IMVP VCCGT (SOC)
- 216
- BBR-0 - RE-TIMER - POWER
- 137
- EC_STRAP
- 177
- virtual battery
- 217
- DG2 TITLE PAGE
- 138
- 178
- S Rail power generation
- 218
- GPU PCIE X16
- 139
- 140
- JTAG/CFG - CFG TERMINATIONS
- 180
- 179
- AUDIO POWER RAILS
- 220
- 219
- GPU GDDR6 CHANNELS M0 M1
- GPU GDDR6 CHANNELS  M2 M3
- 141
- 181
- EDP POWER GENERATION
- 221
- GPU GDDR6 CHANNELS M4 M5
- 142
- 182
- WiFi/BT, LAN, WWAN, PCH SSD *2 rails
- 222
- GPU GDDR6 CHANNELS M6 M7
- 143
- FRONT PANEL - PWR LED AND SWITCH
- 183
- 223
- GPU POWER: VCCGT
- 144
- 145
- FAN
- 184
- 185
- EC POWER RAIL GENERATION
- 225
- 224
- GPU POWER: OTHER
- GPU POWER: GROUND
- 146
- 186
- 226
- GPU:GPIO 1 OF 2
- 147
- 187
- PG3 LOGIC
- 227
- GPU: GPIO 2 OF 2
- 148
- MTG HOLES AND LABELS
- 188
- Memory OC Voltage
- 228
- GPU: DEBUG
- 149
- 150
- 190
- 189
- PECI CONNECTIONS
- POWER METER -PAC1934
- 230
- 229
- GPU: USB & RSVD
- GPU DDI: A,B,C,D
- 151
- 191
- TOUCH PAD CONNECTOR
- 231
- GPU GDDR DEVICE M0
- 152
- PD TEST POINTS
- 192
- GPP_A_B_F_G_H
- 232
- GPU GDDR DEVICE M1
- A
- 153
- DC JACK & RTC COINCELL
- 193
- GPP_MUX_C
- 233
- GPU GDDR DEVICE M2
- 155
- 154
- HPB BATTERY CHARGER- BACK TO BACK
- HPB BATTERY CHARGER
- 194
- 195
- GPP_MUX_A
- GPP_MUX_B
- 235
- 234
- GPU GDDR DEVICE M4
- GPU GDDR DEVICE M3
- 156
- BATTERY PATH
- 196
- GPP_MUX_D
- 236
- GPU GDDR DEVICE M5
- 157
- 197
- LPSS - SMLINK OPTIONS
- 237
- GPU GDDR DEVICE M6
- 158
- V3P3DSW VR
- 198
- LPSS - SMBUS
- 238
- GPU GDDR DEVICE M7
- 159
- 160
- V1P8A GENERATION
- V5A and V3P3A GENERATION
- 200
- 199
- GPP_MUX_J_K
- PCH H CLOCK OPTIONS_2
- 240
- 239
- GPU GDDR DEVICE DECOUPLING, 1 OF 3
- GPU GDDR DEVICE DECOUPLING, 2 OF 3
- Wed May 11 04:00:51 2022
- SIZE
- DOCUMENT NUMBER
- REV
- DEPARTMENT
- Intel Corporation
- 2200 Mission College Blvd.
- 724452
- 0.9
- UNKNOWN
- Santa Clara, CA 95052-8119
- P.O. BOX 58119
- SCALE:
- DO NOT SCALE DRAWING
- SHEET
- 3 OF 274